# EAGLE design BB (EAGLE 5.11)
BOM: EXCLUDE; PARTNO: RMCF0402JT4K70

## Sheet 1 of 4
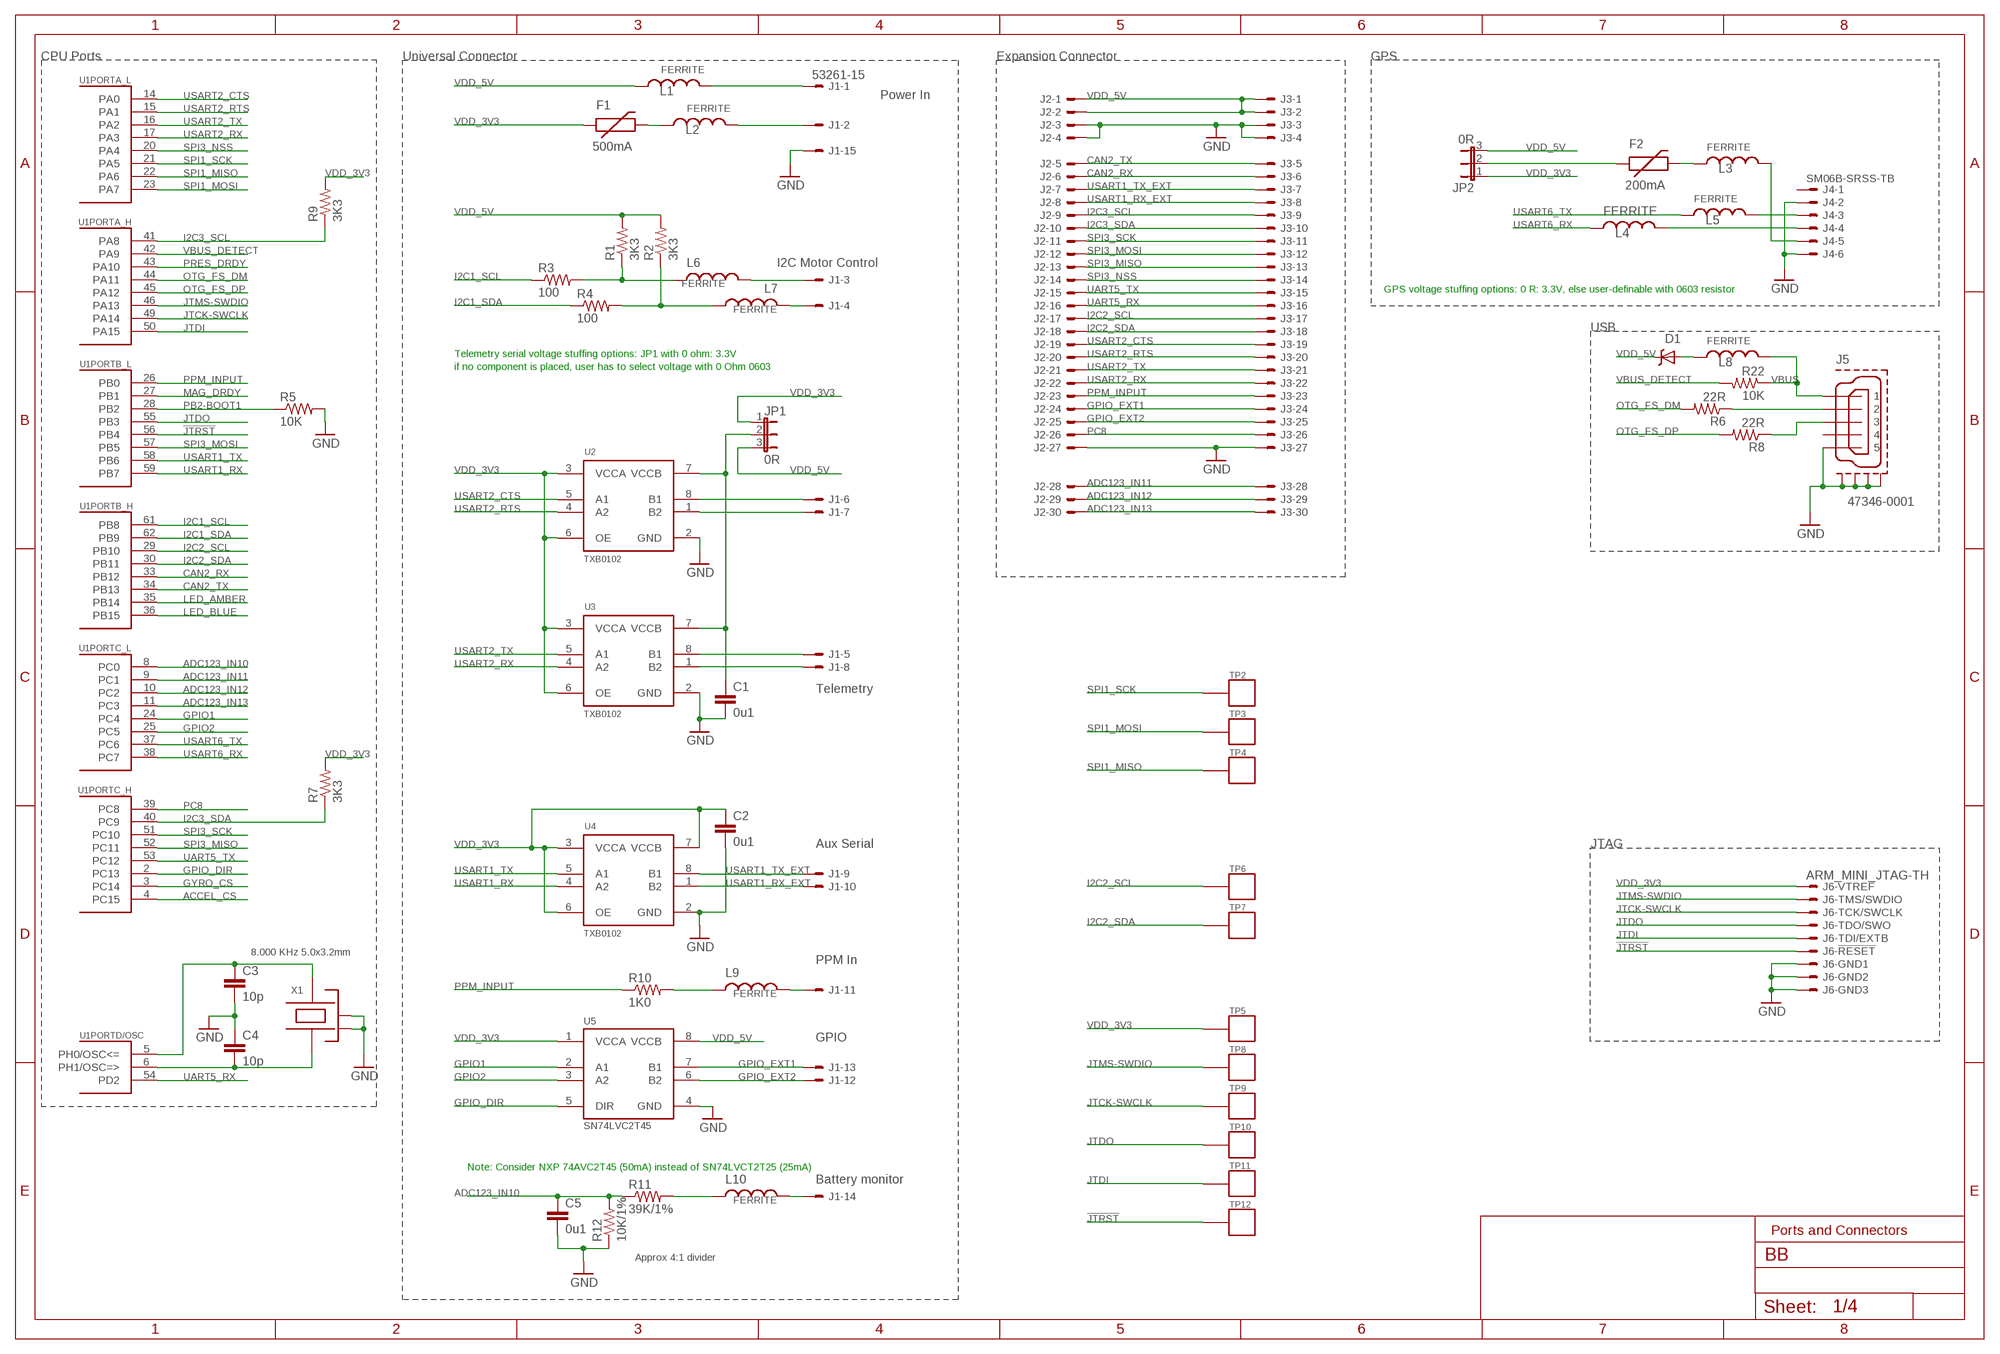
[diagram p0: schematic, sheet 1]

### Parts
C1  0u1  CAP0402-CAP  [0402-CAP]
C2  0u1  CAP0402-CAP  [0402-CAP]
C3  10p  CAP0402-CAP  [0402-CAP]
C4  10p  CAP0402-CAP  [0402-CAP]
C5  0u1  CAP0402-CAP  [0402-CAP]
D1  MSS1P4-M3  DIODE-SCHOTTKY_MSMP  [MICROSMP]
F1  500mA  PTC0402  [0402-PTC]
F2  200mA  PTC0402  [0402-PTC]
J1  53261-15  [53261-15]
J2  HEADER_2X15-REV  [HEADER_2MM_2X15_REVERSE]
J3  HEADER_2X15  [HEADER_2MM_2X15]
J4  SM06B-SRSS-TB  [SM06B-SRSS-TB]
J5  47346-0001  MOLEX-47346-0001  [MOLEX-47346-0001]
J6  ARM_MINI_JTAG-TH  [FTSH-105-01-XXX-DV]
JP1  0R  JUMPER-30603  [SJ_3_0603_PASTE1&2]
JP2  0R  JUMPER-30603  [SJ_3_0603_PASTE1&2]
L1  FERRITE  INDUCTOR0402  [0402-IND]
L2  FERRITE  INDUCTOR0402  [0402-IND]
L3  FERRITE  INDUCTOR0402  [0402-IND]
L4  FERRITE  INDUCTOR0402  [0402-IND]
L5  FERRITE  INDUCTOR0402  [0402-IND]
L6  FERRITE  INDUCTOR0402  [0402-IND]
L7  FERRITE  INDUCTOR0402  [0402-IND]
L8  FERRITE  INDUCTOR0402  [0402-IND]
L9  FERRITE  INDUCTOR0402  [0402-IND]
L10  FERRITE  INDUCTOR0402  [0402-IND]
R1  3K3  RESISTOR0402-RES  [0402-RES]
R2  3K3  RESISTOR0402-RES  [0402-RES]
R3  100  RESISTOR0402-RES  [0402-RES]
R4  100  RESISTOR0402-RES  [0402-RES]
R5  10K  RESISTOR0402-RES  [0402-RES]
R6  22R  RESISTOR0402-RES  [0402-RES]
R7  3K3  RESISTOR0402-RES  [0402-RES]
R8  22R  RESISTOR0402-RES  [0402-RES]
R9  3K3  RESISTOR0402-RES  [0402-RES]
R10  1K0  RESISTOR0402-RES  [0402-RES]
R11  39K/1%  RESISTOR0402-RES  [0402-RES]
R12  10K/1%  RESISTOR0402-RES  [0402-RES]
R22  10K  RESISTOR0402-RES  [0402-RES]
TP2  PAD.03  [PAD.03X.03]
TP3  PAD.03  [PAD.03X.03]
TP4  PAD.03  [PAD.03X.03]
TP5  PAD.03  [PAD.03X.03]
TP6  PAD.03  [PAD.03X.03]
TP7  PAD.03  [PAD.03X.03]
TP8  PAD.03  [PAD.03X.03]
TP9  PAD.03  [PAD.03X.03]
TP10  PAD.03  [PAD.03X.03]
TP11  PAD.03  [PAD.03X.03]
TP12  PAD.03  [PAD.03X.03]
U1  STM32F205RGT6  STM32F20X_TQFP64  [TQFP64]
U2  TXB0102  TXB0102DCUR  [TI-DCU]
U3  TXB0102  TXB0102DCUR  [TI-DCU]
U4  TXB0102  TXB0102DCUR  [TI-DCU]
U5  SN74LVC2T45  SN74LVC2T45DCUR  [TI-DCU]
X1  8.000 KHz 5.0x3.2mm  OSCILLATOR  [OSCILLATOR-5.0X3.2]

### Nets
!JTRST: J6.10 TP12.P$1 U1.56(PORTB_L:PB4)
ACCEL_CS: U1.4(PORTC_H:PC15) ; also sheet 3
ADC123_IN10: C5.1 R11.1 R12.2 U1.8(PORTC_L:PC0)
ADC123_IN11: J2.28 J3.28 U1.9(PORTC_L:PC1)
ADC123_IN12: J2.29 J3.29 U1.10(PORTC_L:PC2)
ADC123_IN13: J2.30 J3.30 U1.11(PORTC_L:PC3)
CAN2_RX: J2.6 J3.6 U1.33(PORTB_H:PB12)
CAN2_TX: J2.5 J3.5 U1.34(PORTB_H:PB13)
GND [power]: C1.2 C2.2 C3.2 C4.1 C5.2 J1.15 J2.3 J2.4 J2.27 J3.3 J3.4 J3.27 J4.2 J4.6 J5.5 J5.GND1 J5.GND2 J5.GND3 J5.GND4 J6.3 J6.5 J6.9 R5.2 R12.1 U2.2(GND) U3.2(GND) U4.2(GND) U5.4(GND) X1.2(NC_2) X1.4(NC_4) ; also sheet 2,3,4
GPIO1: U1.24(PORTC_L:PC4) U5.2(A1)
GPIO2: U1.25(PORTC_L:PC5) U5.3(A2)
GPIO_DIR: U1.2(PORTC_H:PC13) U5.5(DIR)
GPIO_EXT1: J1.13 J2.24 J3.24 U5.7(B1)
GPIO_EXT2: J1.12 J2.25 J3.25 U5.6(B2)
GYRO_CS: U1.3(PORTC_H:PC14) ; also sheet 3
I2C1_SCL: R3.1 U1.61(PORTB_H:PB8)
I2C1_SCL_EXT: L6.1 R1.1 R3.2
I2C1_SDA: R4.1 U1.62(PORTB_H:PB9)
I2C2_SCL: J2.17 J3.17 TP6.P$1 U1.29(PORTB_H:PB10) ; also sheet 2,3,4
I2C2_SDA: J2.18 J3.18 TP7.P$1 U1.30(PORTB_H:PB11) ; also sheet 2,3,4
I2C2_SDA_EXT: L7.1 R2.1 R4.2
I2C3_SCL: J2.9 J3.9 R9.1 U1.41(PORTA_H:PA8)
I2C3_SDA: J2.10 J3.10 R7.1 U1.40(PORTC_H:PC9)
JTCK-SWCLK: J6.4 TP9.P$1 U1.49(PORTA_H:PA14)
JTDI: J6.8 TP11.P$1 U1.50(PORTA_H:PA15)
JTDO: J6.6 TP10.P$1 U1.55(PORTB_L:PB3)
JTMS-SWDIO: J6.2 TP8.P$1 U1.46(PORTA_H:PA13)
LED_AMBER: U1.35(PORTB_H:PB14) ; also sheet 2
LED_BLUE: U1.36(PORTB_H:PB15) ; also sheet 2
MAG_DRDY: U1.27(PORTB_L:PB1) ; also sheet 3,4
N$1: C4.2 U1.6(PORTD/OSC:PH1/OSC=>) X1.1
N$2: C3.1 U1.5(PORTD/OSC:PH0/OSC<=) X1.3
N$3: J1.2 L2.2
N$5: F2.2 L3.1
N$8: J4.4 L4.2
N$11 [power]: C1.1 JP1.2 U2.7(VCCB) U3.7(VCCB)
N$12: J1.6 U2.8(B1)
N$13: J1.7 U2.1(B2)
N$14 [power]: J1.1 L1.2
N$15: J1.5 U3.8(B1)
N$16: J1.8 U3.1(B2)
N$18: F2.1 JP2.2
N$19: J1.3 L6.2
N$23 [power]: D1.ANODE(A) L8.1
N$24 [power]: J4.5 L3.2
N$25: J4.3 L5.2
N$26: J1.4 L7.2
N$27 [power]: F1.2 L2.1
N$31: L9.1 R10.2
N$32: J1.11 L9.2
N$35: L10.1 R11.2
N$37: J1.14 L10.2
OTG_DM: J5.2 R6.1
OTG_DP: J5.3 R8.1
OTG_FS_DM: R6.2 U1.44(PORTA_H:PA11)
OTG_FS_DP: R8.2 U1.45(PORTA_H:PA12)
PB2-BOOT1: R5.1 U1.28(PORTB_L:PB2)
PC8: J2.26 J3.26 U1.39(PORTC_H:PC8)
PPM_INPUT: J2.23 J3.23 R10.1 U1.26(PORTB_L:PB0)
PRES_DRDY: U1.43(PORTA_H:PA10) ; also sheet 3
SPI1_MISO: TP4.P$1 U1.22(PORTA_L:PA6) ; also sheet 3
SPI1_MOSI: TP3.P$1 U1.23(PORTA_L:PA7) ; also sheet 3
SPI1_SCK: TP2.P$1 U1.21(PORTA_L:PA5) ; also sheet 3
SPI3_MISO: J2.13 J3.13 U1.52(PORTC_H:PC11)
SPI3_MOSI: J2.12 J3.12 U1.57(PORTB_L:PB5)
SPI3_NSS: J2.14 J3.14 U1.20(PORTA_L:PA4)
SPI3_SCK: J2.11 J3.11 U1.51(PORTC_H:PC10)
UART5_RX: J2.16 J3.16 U1.54(PORTD/OSC:PD2)
UART5_TX: J2.15 J3.15 U1.53(PORTC_H:PC12)
USART1_RX: U1.59(PORTB_L:PB7) U4.4(A2)
USART1_RX_EXT: J1.10 J2.8 J3.8 U4.1(B2)
USART1_TX: U1.58(PORTB_L:PB6) U4.5(A1)
USART1_TX_EXT: J1.9 J2.7 J3.7 U4.8(B1)
USART2_CTS: J2.19 J3.19 U1.14(PORTA_L:PA0) U2.5(A1)
USART2_RTS: J2.20 J3.20 U1.15(PORTA_L:PA1) U2.4(A2)
USART2_RX: J2.22 J3.22 U1.17(PORTA_L:PA3) U3.4(A2)
USART2_TX: J2.21 J3.21 U1.16(PORTA_L:PA2) U3.5(A1)
USART6_RX: L4.1 U1.38(PORTC_L:PC7)
USART6_TX: L5.1 U1.37(PORTC_L:PC6)
VBUS [power]: J5.1 L8.2 R22.1
VBUS_DETECT: R22.2 U1.42(PORTA_H:PA9)
VDD_3V3 [power]: C2.1 F1.1 J6.1 JP1.1 JP2.1 R7.2 R9.2 TP5.P$1 U2.3(VCCA) U2.6(OE) U3.3(VCCA) U3.6(OE) U4.3(VCCA) U4.6(OE) U4.7(VCCB) U5.1(VCCA) ; also sheet 2,3
VDD_5V [power]: D1.CATHODE(C) J2.1 J2.2 J3.1 J3.2 JP1.3 JP2.3 L1.1 R1.2 R2.2 U5.8(VCCB) ; also sheet 2
Unconnected: J4.1 J5.4

### Notes on the sheet
- CPU Ports | Universal Connector | Expansion Connector | GPS
- Power In
- I2C Motor Control
- GPS voltage stuffing options: 0 R: 3.3V, else user-definable with 0603 resistor
- USB
- Telemetry serial voltage stuffing options: JP1 with 0 ohm: 3.3V
- if no component is placed, user has to select voltage with 0 Ohm 0603
- Telemetry
- Aux Serial | JTAG
- PPM In
- GPIO
- Note: Consider NXP 74AVC2T45 (50mA) instead of SN74LVCT2T25 (25mA)
- Battery monitor
- Ports and Connectors
- Approx 4:1 divider

## Sheet 2 of 4
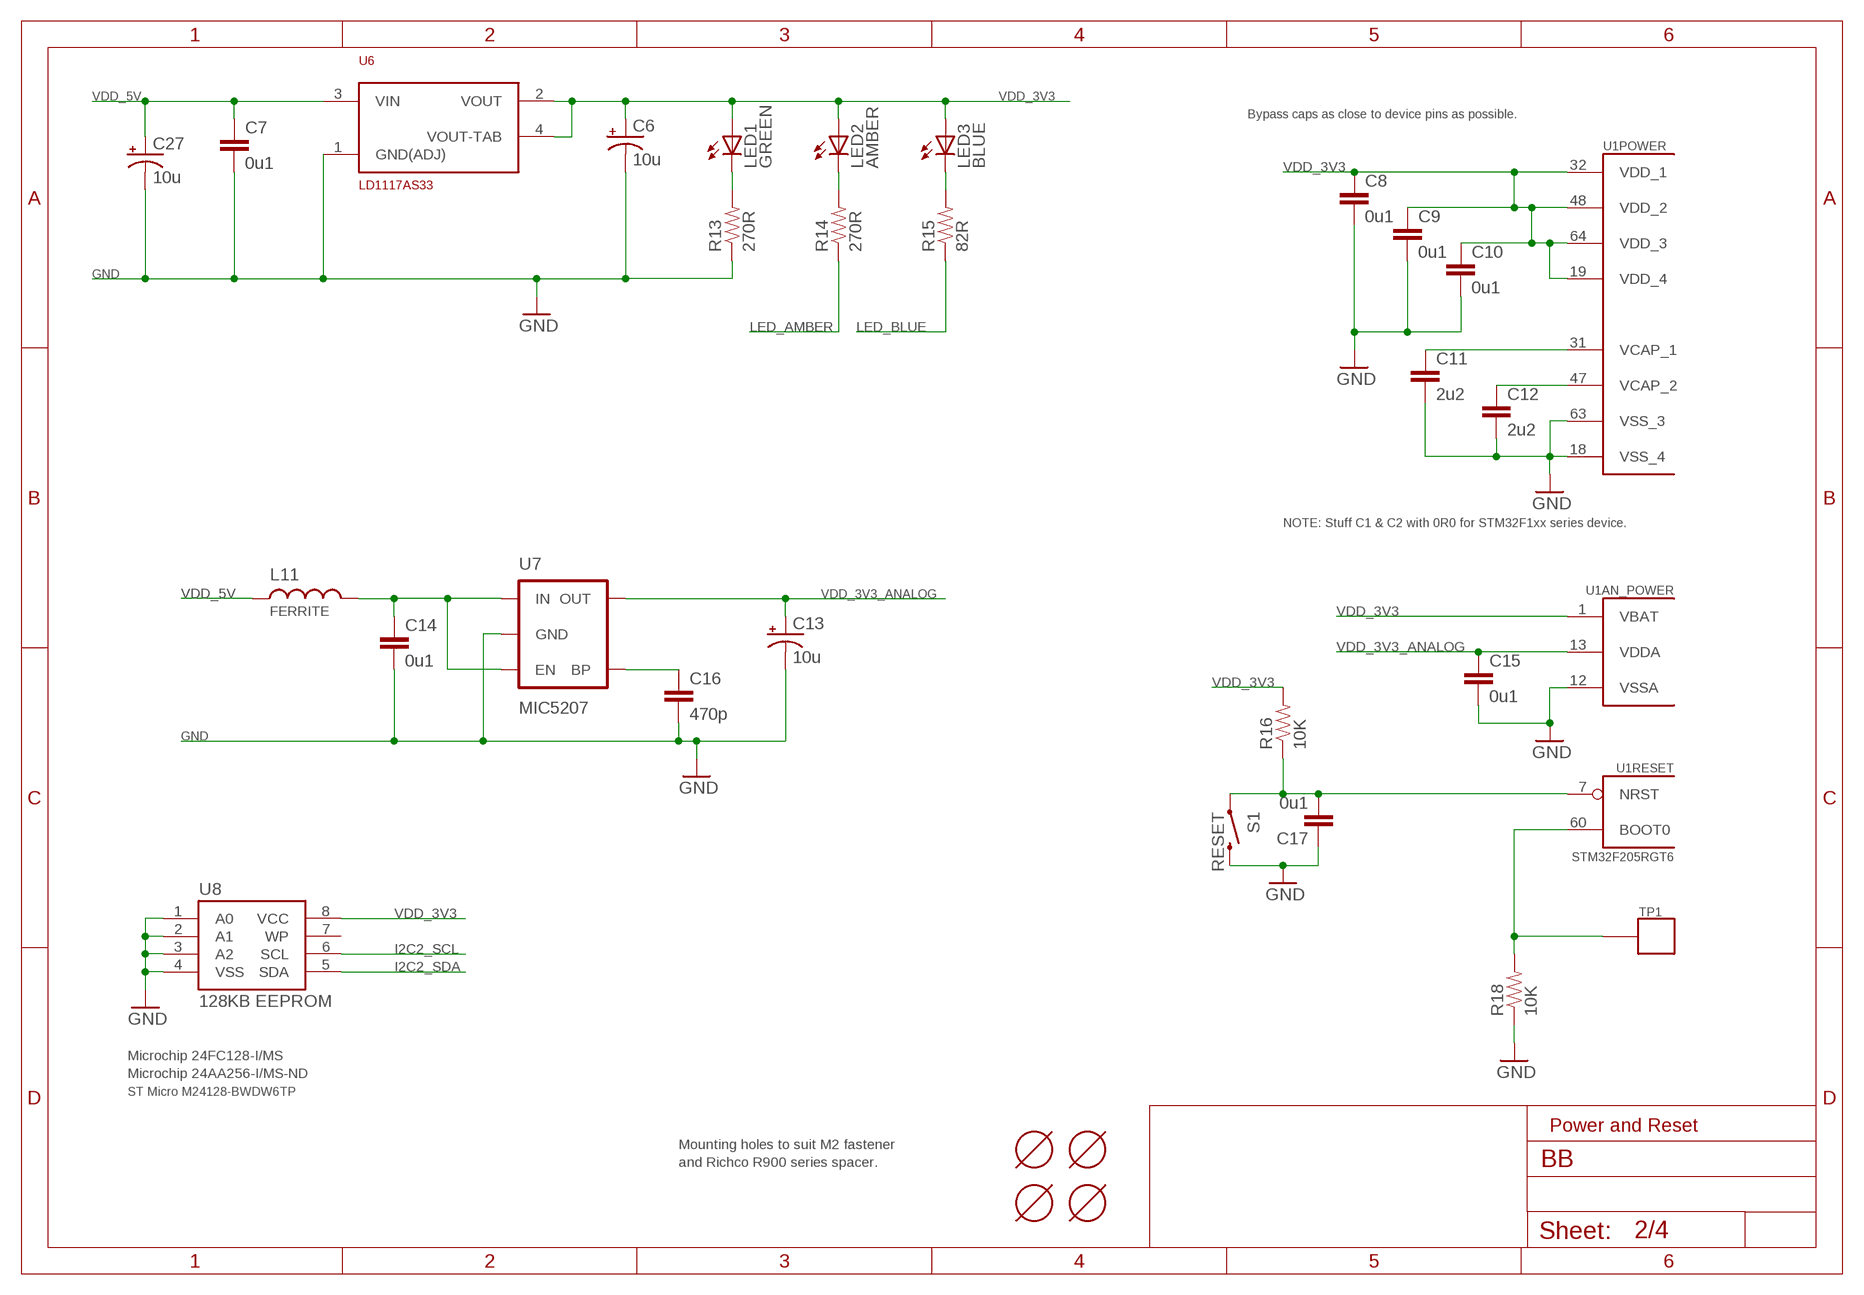
[diagram p1: schematic, sheet 2]

### Parts
C6  10u  CAP_POL1206  [EIA3216]
C7  0u1  CAP0402-CAP  [0402-CAP]
C8  0u1  CAP0402-CAP  [0402-CAP]
C9  0u1  CAP0402-CAP  [0402-CAP]
C10  0u1  CAP0402-CAP  [0402-CAP]
C11  2u2  CAP0402-CAP  [0402-CAP]
C12  2u2  CAP0402-CAP  [0402-CAP]
C13  10u  CAP_POL1206  [EIA3216]
C14  0u1  CAP0402-CAP  [0402-CAP]
C15  0u1  CAP0402-CAP  [0402-CAP]
C16  470p  CAP0402-CAP  [0402-CAP]
C17  0u1  CAP0402-CAP  [0402-CAP]
C27  10u  CAP_POL1206  [EIA3216]
L11  FERRITE  INDUCTOR0402  [0402-IND]
LED1  GREEN  LED0603  [LED-0603]
LED2  AMBER  LED0603  [LED-0603]
LED3  BLUE  LED0603  [LED-0603]
R13  270R  RESISTOR0402-RES  [0402-RES]
R14  270R  RESISTOR0402-RES  [0402-RES]
R15  82R  RESISTOR0402-RES  [0402-RES]
R16  10K  RESISTOR0402-RES  [0402-RES]
R18  10K  RESISTOR0402-RES  [0402-RES]
S1  RESET  SWITCH-MOMENTARY-2  [EVQP7J01K]
TP1  PAD.03  [PAD.03X.03]
U6  LD1117AS33  [SOT-223]
U7  MIC5207  V_REG_LDOSMD  [SOT23-5]
U8  128KB EEPROM  EEPROM-I2CMSOP  [MSOP-8]
U$1  MOUNT-HOLE2.1MM  [MOUNT-HOLE2.1]
U$2  MOUNT-HOLE2.1MM  [MOUNT-HOLE2.1]
U$3  MOUNT-HOLE2.1MM  [MOUNT-HOLE2.1]
U$4  MOUNT-HOLE2.1MM  [MOUNT-HOLE2.1]

### Nets
BOOT0: R18.2 TP1.P$1 U1.60(RESET:BOOT0)
GND [power]: C6.C(-) C7.2 C8.2 C9.2 C10.2 C11.2 C12.2 C13.C(-) C14.2 C15.2 C16.2 C17.1 C27.C(-) R13.1 R18.1 S1.B3 U1.12(AN_POWER:VSSA) U1.18(POWER:VSS_4) U1.63(POWER:VSS_3) U6.1(GND(ADJ)) U7.2(GND) U8.1(A0) U8.2(A1) U8.3(A2) U8.4(VSS) ; also sheet 1,3,4
I2C2_SCL: U8.6(SCL) ; also sheet 1,3,4
I2C2_SDA: U8.5(SDA) ; also sheet 1,3,4
LED_AMBER: R14.1 ; also sheet 1
LED_BLUE: R15.1 ; also sheet 1
N$4: C11.1 U1.31(POWER:VCAP_1)
N$6: C12.1 U1.47(POWER:VCAP_2)
N$9: C16.1 U7.4(BP)
N$22: C17.2 R16.1 S1.A1 U1.7(RESET:NRST)
N$28: LED3.C R15.2
N$29: LED1.C R13.2
N$30: LED2.C R14.2
N$100 [power]: C14.1 L11.2 U7.1(IN) U7.3(EN)
VDD_3V3 [power]: C6.A(+) C8.1 C9.1 C10.1 LED1.A LED2.A LED3.A R16.2 U1.1(AN_POWER:VBAT) U1.19(POWER:VDD_4) U1.32(POWER:VDD_1) U1.48(POWER:VDD_2) U1.64(POWER:VDD_3) U6.2(VOUT) U6.4(VOUT-TAB) U8.8(VCC) ; also sheet 1,3
VDD_3V3_ANALOG [power]: C13.A(+) C15.1 U1.13(AN_POWER:VDDA) U7.5(OUT) ; also sheet 3,4
VDD_5V [power]: C7.1 C27.A(+) L11.1 U6.3(VIN) ; also sheet 1
Unconnected: U8.7(WP)

### Notes on the sheet
- Bypass caps as close to device pins as possible.
- NOTE: Stuff C1 & C2 with 0R0 for STM32F1xx series device.
- Microchip 24FC128-I/MS
- Microchip 24AA256-I/MS-ND
- ST Micro M24128-BWDW6TP
- Power and Reset
- Mounting holes to suit M2 fastener
- and Richco R900 series spacer.

## Sheet 3 of 4
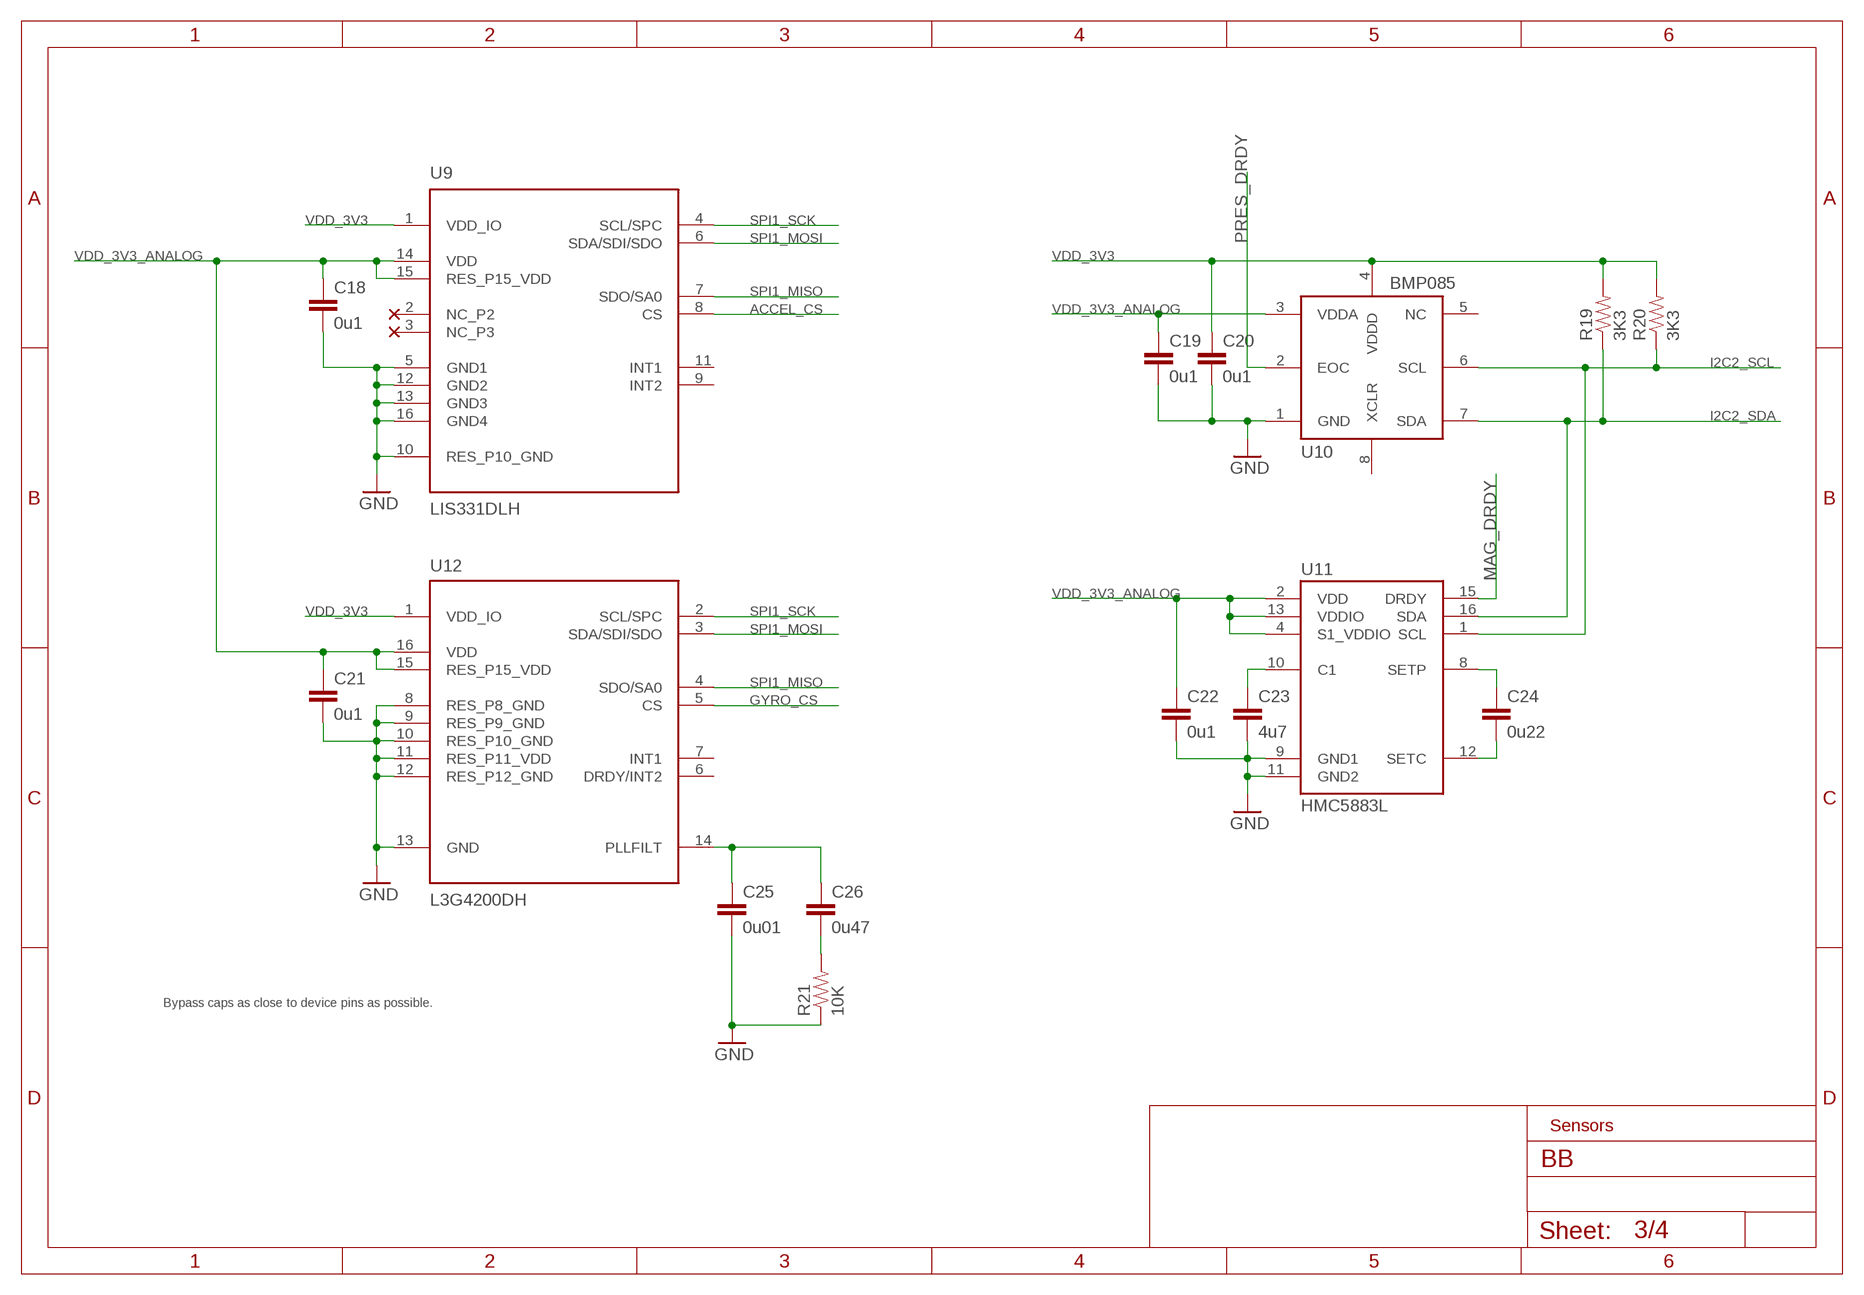
[diagram p2: schematic, sheet 3]

### Parts
C18  0u1  CAP0402-CAP  [0402-CAP]
C19  0u1  CAP0402-CAP  [0402-CAP]
C20  0u1  CAP0402-CAP  [0402-CAP]
C21  0u1  CAP0402-CAP  [0402-CAP]
C22  0u1  CAP0402-CAP  [0402-CAP]
C23  4u7  CAP0402-CAP  [0402-CAP]
C24  0u22  CAP0402-CAP  [0402-CAP]
C25  0u01  CAP0402-CAP  [0402-CAP]
C26  0u47  CAP0402-CAP  [0402-CAP]
R19  3K3  RESISTOR0402-RES  [0402-RES]
R20  3K3  RESISTOR0402-RES  [0402-RES]
R21  10K  RESISTOR0402-RES  [0402-RES]
U9  LIS331DLH  LIS331DLH-LL  [LIS331DLH-MAN]
U10  BMP085  [BMP085]
U11  HMC5883L  [HMC5883L-MAN]
U12  L3G4200DH  L3G4200DH-LL  [L3G4200DH-MAN]

### Nets
ACCEL_CS: U9.8(CS) ; also sheet 1
GND [power]: C18.2 C19.2 C20.2 C21.2 C22.2 C23.2 C25.2 R21.1 U9.5(GND1) U9.10(RES_P10_GND) U9.12(GND2) U9.13(GND3) U9.16(GND4) U10.1(GND) U11.9(GND1) U11.11(GND2) U12.8(RES_P8_GND) U12.9(RES_P9_GND) U12.10(RES_P10_GND) U12.11(RES_P11_VDD) U12.12(RES_P12_GND) U12.13(GND) ; also sheet 1,2,4
GYRO_CS: U12.5(CS) ; also sheet 1
I2C2_SCL: R20.1 U10.6(SCL) U11.1(SCL) ; also sheet 1,2,4
I2C2_SDA: R19.1 U10.7(SDA) U11.16(SDA) ; also sheet 1,2,4
MAG_DRDY: U11.15(DRDY) ; also sheet 1,4
N$10: C24.1 U11.8(SETP)
N$17: C24.2 U11.12(SETC)
N$33: C26.2 R21.2
N$34: C25.1 C26.1 U12.14(PLLFILT)
N$36: C23.1 U11.10(C1)
PRES_DRDY: U10.2(EOC) ; also sheet 1
SPI1_MISO: U9.7(SDO/SA0) U12.4(SDO/SA0) ; also sheet 1
SPI1_MOSI: U9.6(SDA/SDI/SDO) U12.3(SDA/SDI/SDO) ; also sheet 1
SPI1_SCK: U9.4(SCL/SPC) U12.2(SCL/SPC) ; also sheet 1
VDD_3V3 [power]: C20.1 R19.2 R20.2 U9.1(VDD_IO) U10.4(VDDD) U12.1(VDD_IO) ; also sheet 1,2
VDD_3V3_ANALOG [power]: C18.1 C19.1 C21.1 C22.1 U9.14(VDD) U9.15(RES_P15_VDD) U10.3(VDDA) U11.2(VDD) U11.4(S1_VDDIO) U11.13(VDDIO) U12.15(RES_P15_VDD) U12.16(VDD) ; also sheet 2,4
Unconnected: U9.2(NC_P2) U9.3(NC_P3) U9.9(INT2) U9.11(INT1) U10.5(NC) U10.8(XCLR) U11.3(NC_P3) U11.5(NC_P5) U11.6(NC_P6) U11.7(NC_P7) U11.14(NC_P14) U12.6(DRDY/INT2) U12.7(INT1)

### Notes on the sheet
- Bypass caps as close to device pins as possible.
- Sensors

## Sheet 4 of 4
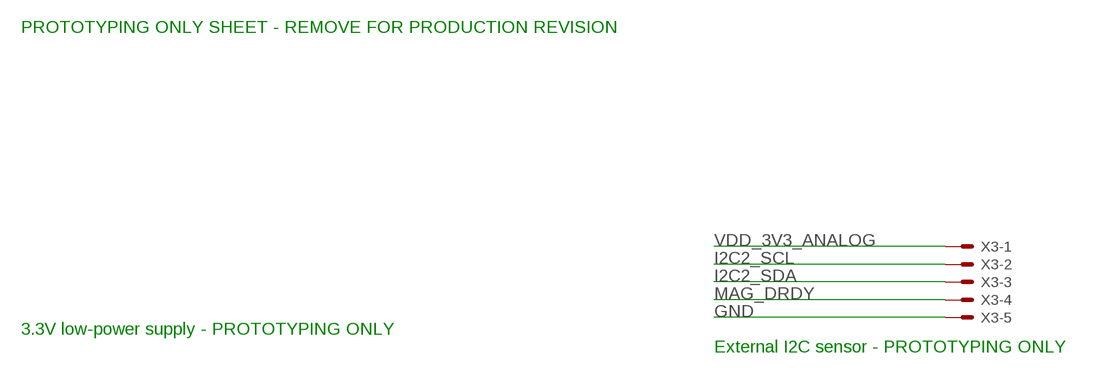
[diagram p3: schematic, sheet 4]

### Parts
X3  53261-05  [53261-05]

### Nets
GND [power]: X3.5 ; also sheet 1,2,3
I2C2_SCL: X3.2 ; also sheet 1,2,3
I2C2_SDA: X3.3 ; also sheet 1,2,3
MAG_DRDY: X3.4 ; also sheet 1,3
VDD_3V3_ANALOG [power]: X3.1 ; also sheet 2,3

### Notes on the sheet
- PROTOTYPING ONLY SHEET - REMOVE FOR PRODUCTION REVISION
- 3.3V low-power supply - PROTOTYPING ONLY
- External I2C sensor - PROTOTYPING ONLY

## Library data of the parts
C1-C5 C7-C12 C14-C26 = pixhawk2:CAP: Capacitor Standard 0603 ceramic capacitor, and 0.1" leaded capacitor.
C6 C13 C27 = pixhawk2:CAP_POL: Capacitor Polarized These are standard SMD and PTH capacitors. Normally 10uF, 47uF, and 100uF in electrolytic and tantalum varieties. Always verify the external diameter of the through hole cap, it varies with capacity, voltage, and manufacturer. The EIA devices should be standard.
D1 = pixhawk2:DIODE-SCHOTTKY: Schottky barrier diode in DO214AC, e.g. Fairchild SS14.
F1 F2 = pixhawk2:PTC: Resettable Fuse PTC Resettable Fuse. Spark Fun Electronics SKU : COM-08357
J1 = pixhawk2:53?-15: CONNECTOR wire to board 1.25 mm (.049 inch) pitch header
J2 J3 = pixhawk2:HEADER_2X15: 2X15 header
J4 = pixhawk2:?M06B-SRSS-TB: Disconnectable Crimp style connector, 1.0mm pitch 6 contacts
J5 = pixhawk2:MOLEX-47346-0001: MICRO USB B, BOTTOM MOUNT
J6 = pixhawk2:ARM_MINI_JTAG: CONNECTOR wire to board 1.25 mm (.049 inch) pitch header
JP1 JP2 = pixhawk2:JUMPER-3
L1-L11 = pixhawk2:INDUCTOR: Inductors Basic Inductor/Choke - 0603 and 1206. Footprints are not proven and vary greatly between part numbers.
LED1-LED3 = pixhawk2:LED: LEDs Standard schematic elements and footprints for 5mm, 3mm, 1206, and 0603 sized LEDs. 5mm - Spark Fun Electronics SKU : COM-00529 (and others)
R1-R16 R18-R22 = pixhawk2:RESISTOR: Resistor Basic schematic elements and footprints for 0603, 1206, and PTH 1/10th watt (small) resistors.
S1 = pixhawk2:SWITCH-MOMENTARY-2
TP1-TP12 = pixhawk2:PAD
U1 = pixhawk2:STM32F20X_TQFP64: STM32F20x 64pin LQFP
U2-U4 = pixhawk2:TXB0102: 2-BIT BIDIRECTIONAL VOLTAGE-LEVEL TRANSLATOR WITH AUTO DIRECTION SENSING AND ±15-kV ESD PROTECTION
U5 = pixhawk2:SN74LVC2T45: DUAL-BIT DUAL-SUPPLY BUS TRANSCEIVER WITH CONFIGURABLE VOLTAGE TRANSLATION AND 3-STATE OUTPUTS
U6 = pixhawk2:LD1117A: LD1117A LDO Datasheet: http://www.st.com/stonline/books/pdf/docs/7194.pdf
U7 = pixhawk2:V_REG_LDO: Voltage Regulator LDO Standard 150mA LDO voltage regulator in SOT-23 layout. Micrel part MIC5205. BP (by-pass) pin is used to lower output noise with 470pF cap.
U8 = pixhawk2:EEPROM-I2C
U9 = pixhawk2:LIS331DLH: LIS331DLH - Digital 3-axis accelerometer The LIS331DLH is an ultra low-power high performance three axes linear accelerometer belonging to the ?nano? family, with digital I2C/SPI serial interface standard output. The LIS331DLH has dynamically user selectable full scales of ±2g/±4g/±8g and it is capable of measuring accelerations with output data rates from 0.5 Hz to 1 kHz. It is guaranteed to operate over an extended temperature range from -40 °C to +85 °C. LIS331DLH Datasheet <http://www.st.com/internet/com/TECHNICAL_RESOURCES/TECHNICAL_LITERATURE/DATASHEET/CD00213470.pdf>
U10 = pixhawk2:BMP085
U11 = pixhawk2:HMC5883L: Honeywell HMC5883L 12bit Magnetometer
U12 = pixhawk2:L3G4200DH: L3G4200DH - Digital 3-axis Gyroscope The L3G4200DH is a low-power three-axis angular rate sensor. The L3G4200DH has a full scale of ±250/±500/ ±2000 dps and is capable of measuring rates with a user-selectable bandwidth. It can operate within a temperature range from -40 °C to +85 °C. Supply voltage: 2.4 V to 3.6 V. Full datasheet: L3G4200DH Datasheet <http://www.st.com/stonline/products/literature/ds/17300.pdf>
U$1-U$4 = pixhawk2:MOUNT-HOLE
X1 = pixhawk2:OSCILLATOR: Crystal Oscillator in 3.2x2.5 SMD
X3 = pixhawk2:53?-05: CONNECTOR wire to board 1.25 mm (.049 inch) pitch header

## Net classes
0 signal: width 0.203 mm, drill 0.3 mm, clearance 0.203 mm
1 power: width 0.254 mm, drill 0.3 mm, clearance 0.203 mm

## Board
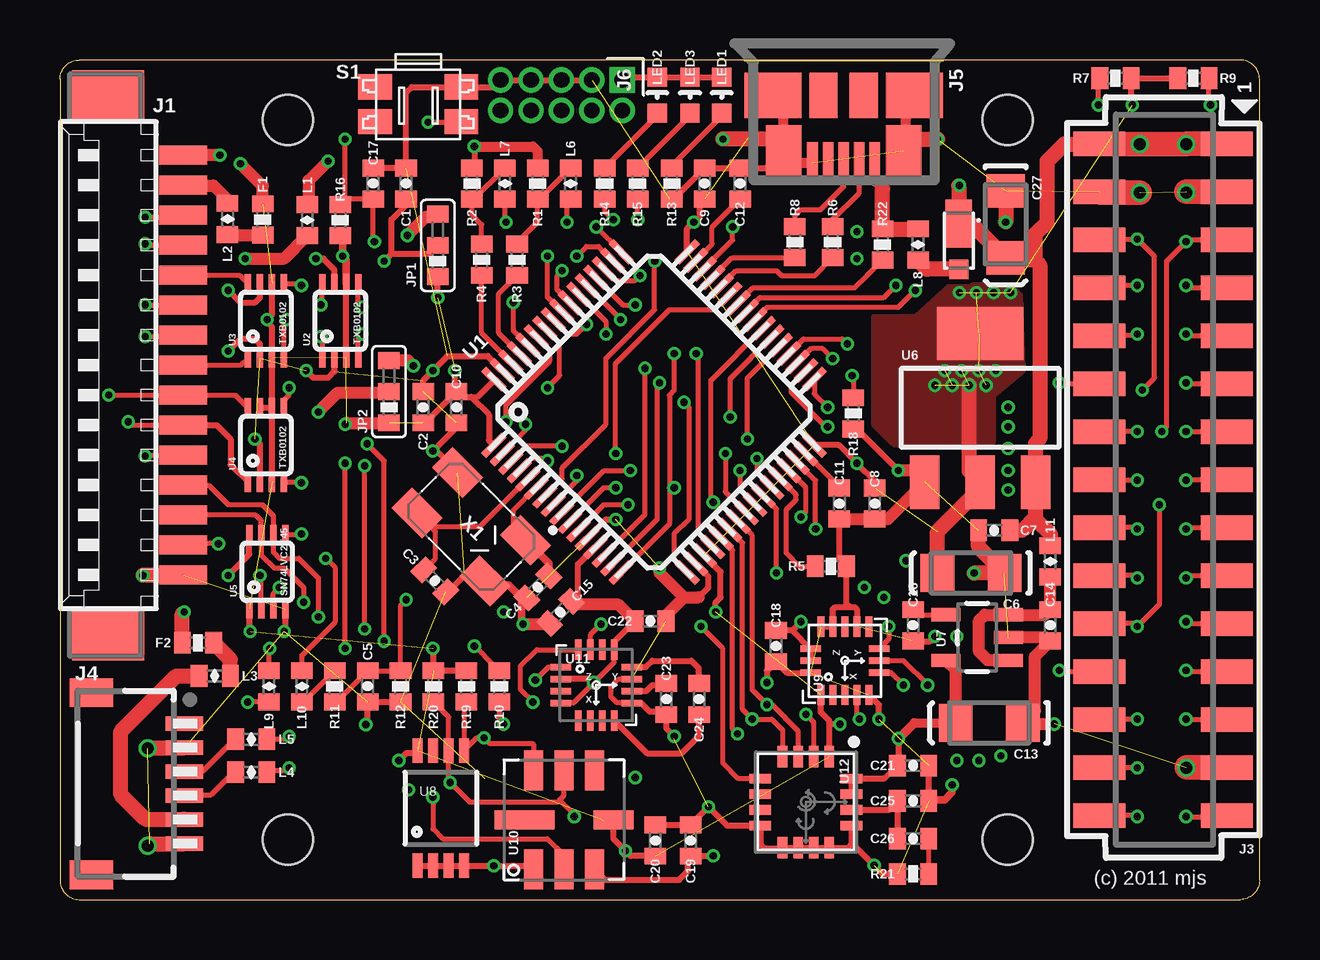
[diagram p4: board, top side]
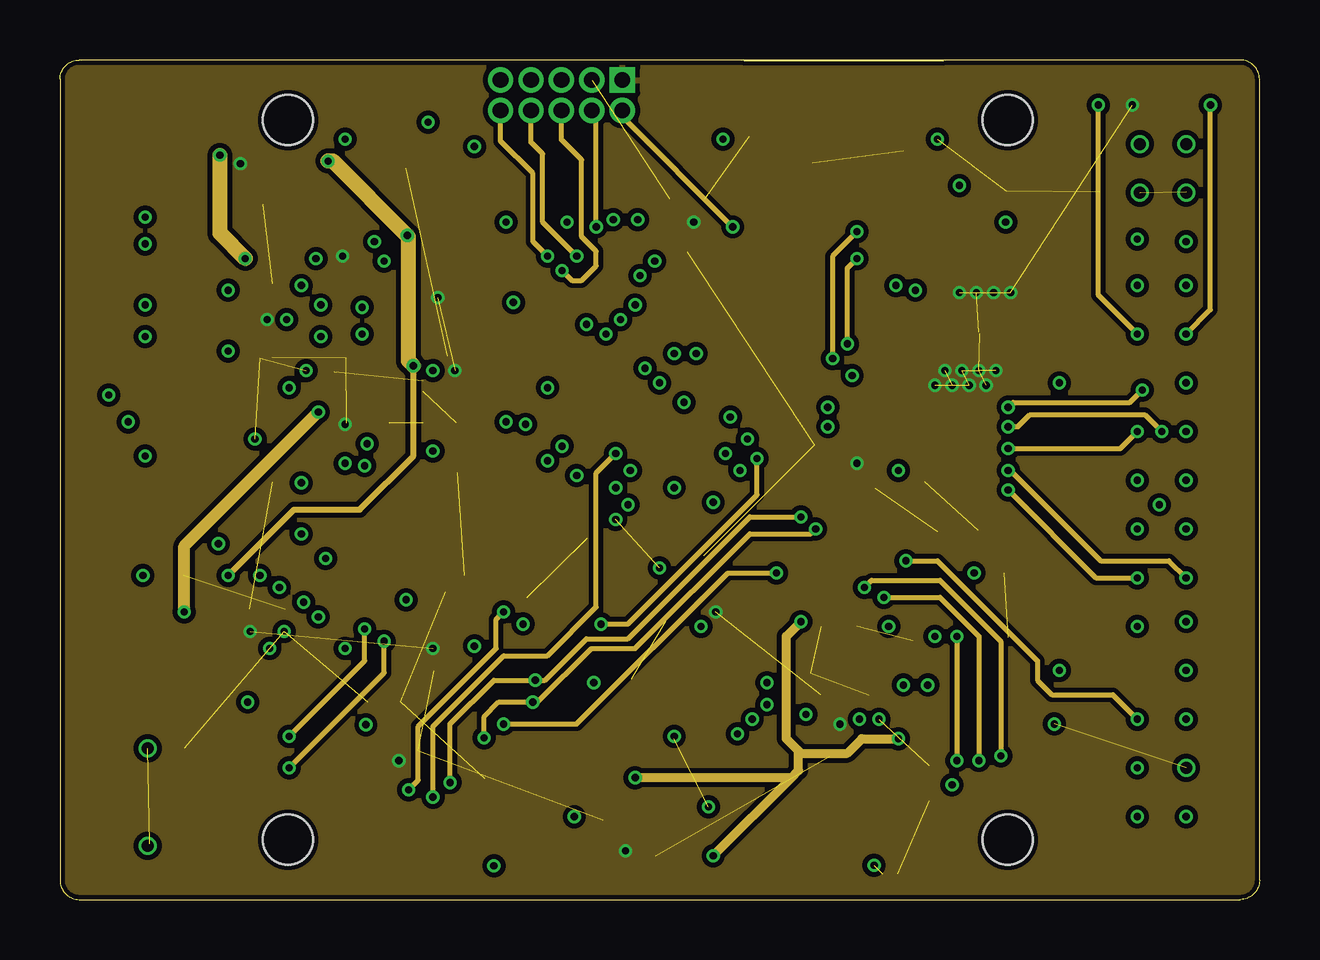
[diagram p5: board, inner layer Route2]
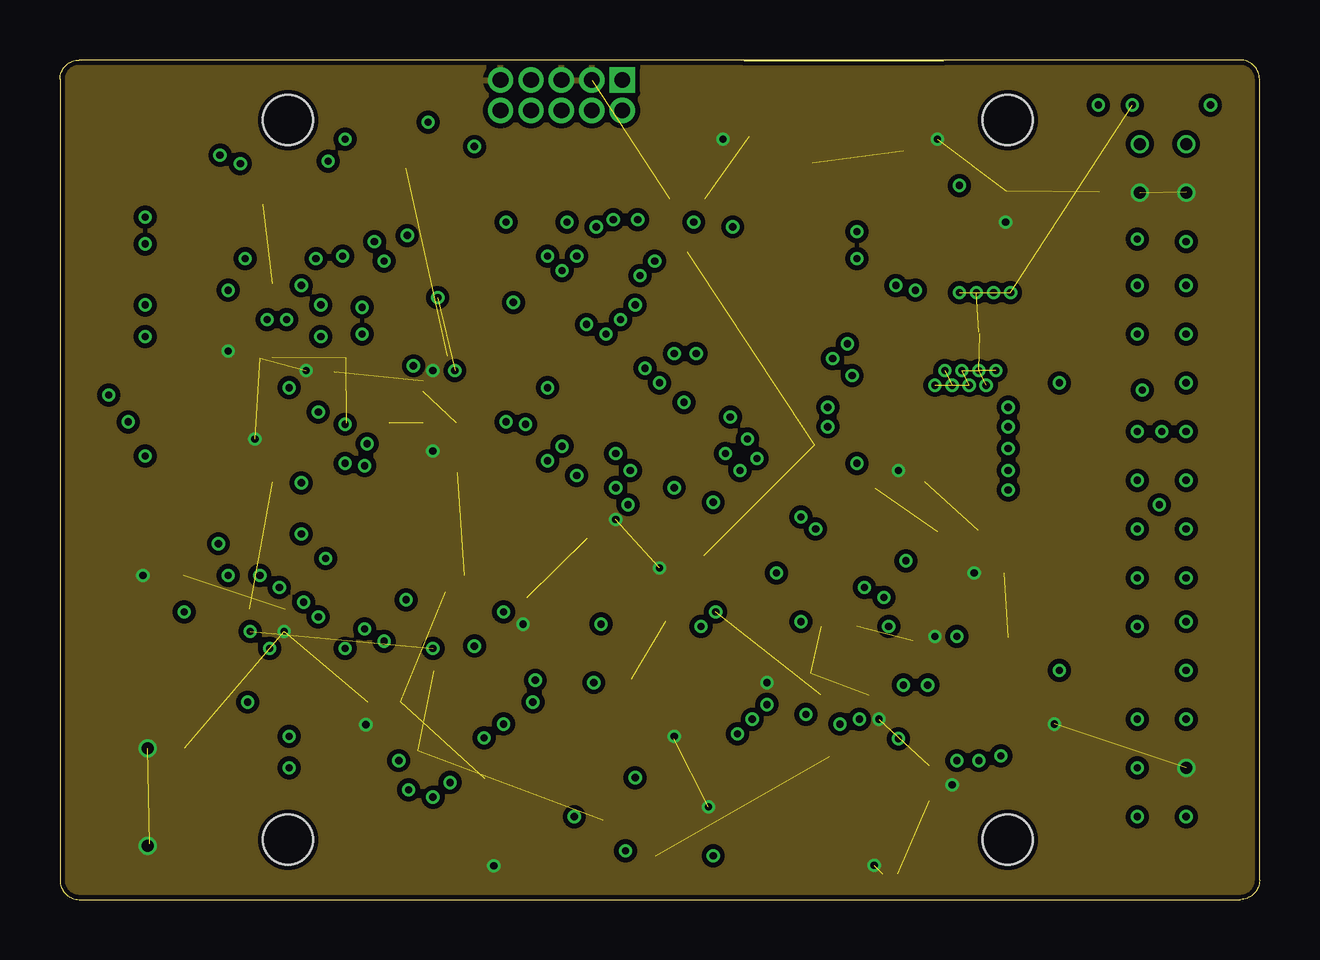
[diagram p6: board, inner layer Route15]
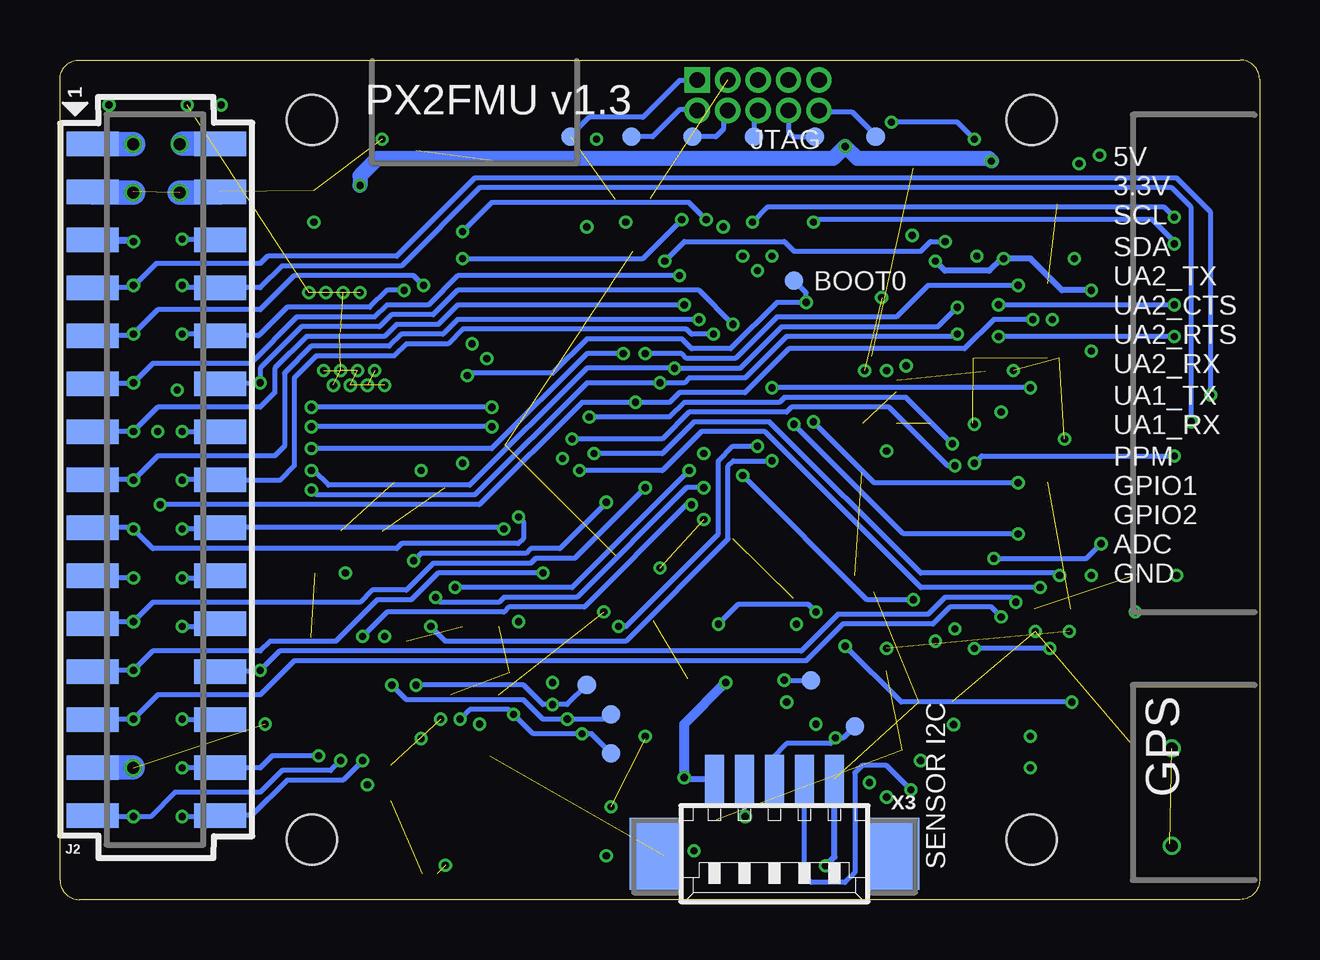
[diagram p7: board, bottom side, seen from below]

Size 50 x 35 mm. Coordinates in mm from the lower left corner, seen from the top.
Outline: 0,0.8 arc90 0.8,0 49.2,0 arc90 50,0.8 50,34.2 arc90 49.2,35 0.8,35 arc90 0,34.2 0,0.8
Copper layers (1*2*15*16): Top 0.035mm / dielectric 0.5mm / Route2 0.035mm / dielectric 0.5mm / Route15 0.035mm / dielectric 0.5mm / Bottom 0.035mm
Design rules "pixhawk2": minimum track width 0.15mm, minimum drill 0.3mm, track to track 0.15mm, track to pad 0.15mm, pad to pad 0.15mm, via to via 0.15mm, smd to smd 0.15mm, copper to edge 0.2mm, drill to drill 0.2mm, minimum pad ring 0.125mm, minimum via ring 0.125mm, stop-mask expansion 1mil, vias tented up to drill 0.31mm, thermal gap 8mil

### Footprints (pad centres in the part's own frame; a part is rotated, then mirrored left to right if it is on the bottom)
0402-CAP = smd 0.7 x 0.9: 1 -0.65,0; 2 0.65,0
EIA3216 = smd 1.4 x 1.6: A 1.4,0; C -1.4,0
MICROSMP = smd 0.8 x 0.8: ANODE 0.65,0 | smd 2 x 1.1: CATHODE -1.25,0
0402-PTC = smd 0.7 x 0.9: 1 -0.65,0; 2 0.65,0
53261-15 = smd 0.8 x 2: 1 8.75,-2.5; 2 7.5,-2.5; 3 6.25,-2.5; 4 5,-2.5; 5 3.75,-2.5; 6 2.5,-2.5; 7 1.25,-2.5; 8 0,-2.5; 9 -1.25,-2.5; 10 -2.5,-2.5; 11 -3.75,-2.5; 12 -5,-2.5; 13 -6.25,-2.5; 14 -7.5,-2.5; 15 -8.75,-2.5 | smd 2.1 x 3: S1 11.25,0.625; S2 -11.25,0.625
HEADER_2MM_2X15_REVERSE = smd 1.02 x 2.16: 1 -14,-2.655; 2 -14,2.655; 3 -12,-2.655; 4 -12,2.655; 5 -10,-2.655; 6 -10,2.655; 7 -8,-2.655; 8 -8,2.655; 9 -6,-2.655; 10 -6,2.655; 11 -4,-2.655; 12 -4,2.655; 13 -2,-2.655; 14 -2,2.655; 15 0,-2.655; 16 0,2.655; 17 2,-2.655; 18 2,2.655; 19 4,-2.655; 20 4,2.655; 21 6,-2.655; 22 6,2.655; 23 8,-2.655; 24 8,2.655; 25 10,-2.655; 26 10,2.655; 27 12,-2.655; 28 12,2.655; 29 14,-2.655; 30 14,2.655
HEADER_2MM_2X15 = smd 1.02 x 2.16: 1 14,-2.655; 2 14,2.655; 3 12,-2.655; 4 12,2.655; 5 10,-2.655; 6 10,2.655; 7 8,-2.655; 8 8,2.655; 9 6,-2.655; 10 6,2.655; 11 4,-2.655; 12 4,2.655; 13 2,-2.655; 14 2,2.655; 15 0,-2.655; 16 0,2.655; 17 -2,-2.655; 18 -2,2.655; 19 -4,-2.655; 20 -4,2.655; 21 -6,-2.655; 22 -6,2.655; 23 -8,-2.655; 24 -8,2.655; 25 -10,-2.655; 26 -10,2.655; 27 -12,-2.655; 28 -12,2.655; 29 -14,-2.655; 30 -14,2.655
SM06B-SRSS-TB = smd 0.6 x 1.55: 1 -2.5,2.975; 2 -1.5,2.975; 3 -0.5,2.975; 4 0.5,2.975; 5 1.5,2.975; 6 2.5,2.975 | smd 1.2 x 1.8: FIT@1 -3.8,-0.9; FIT@2 3.8,-0.9
MOLEX-47346-0001 = smd 1.7 x 0.44: 1 2.8,1.3; 2 2.8,0.65; 3 2.8,0; 4 2.8,-0.65; 5 2.8,-1.3 | smd 1.9 x 2.375: GND1 0,2.95; GND4 0,-2.95 | smd 2.1 x 1.475: GND2 2.3,2.5; GND3 2.3,-2.5 | smd 1.9 x 1.175: GND5 0,-0.838; GND6 0,0.838
FTSH-105-01-XXX-DV = drill 0.65 pad 1.06 square: 1 0,0 | drill 0.65 pad 1.06 round: 2 0,1.27; 3 1.27,0; 4 1.27,1.27; 5 2.54,0; 6 2.54,1.27; 7 3.81,0; 8 3.81,1.27; 9 5.08,0; 10 5.08,1.27
SJ_3_0603_PASTE1&2 = smd 0.7 x 0.9: 1 -0.65,0; 2 0.65,0; 3 1.95,0
0402-IND = smd 0.7 x 0.9: 1 -0.65,0; 2 0.65,0
LED-0603 = smd 0.8 x 0.8: A 0,-0.75; C 0,0.75
0402-RES = smd 0.7 x 0.9: 1 -0.65,0; 2 0.65,0
EVQP7J01K = smd 1.4 x 1.05: A1 -1.8,0.725; A2 1.8,0.725; B3 -1.8,-0.725; B4 1.8,-0.725
PAD.03X.03 = smd 0.762 x 0.762: P$1 0,0
TQFP64 = smd 1.2 x 0.29: 1 -5.7,3.75; 2 -5.7,3.25; 3 -5.7,2.75; 4 -5.7,2.25; 5 -5.7,1.75; 6 -5.7,1.25; 7 -5.7,0.75; 8 -5.7,0.25; 9 -5.7,-0.25; 10 -5.7,-0.75; 11 -5.7,-1.25; 12 -5.7,-1.75; 13 -5.7,-2.25; 14 -5.7,-2.75; 15 -5.7,-3.25; 16 -5.7,-3.75; 33 5.7,-3.75; 34 5.7,-3.25; 35 5.7,-2.75; 36 5.7,-2.25; 37 5.7,-1.75; 38 5.7,-1.25; 39 5.7,-0.75; 40 5.7,-0.25; 41 5.7,0.25; 42 5.7,0.75; 43 5.7,1.25; 44 5.7,1.75; 45 5.7,2.25; 46 5.7,2.75; 47 5.7,3.25; 48 5.7,3.75 | smd 0.29 x 1.2: 17 -3.75,-5.7; 18 -3.25,-5.7; 19 -2.75,-5.7; 20 -2.25,-5.7; 21 -1.75,-5.7; 22 -1.25,-5.7; 23 -0.75,-5.7; 24 -0.25,-5.7; 25 0.25,-5.7; 26 0.75,-5.7; 27 1.25,-5.7; 28 1.75,-5.7; 29 2.25,-5.7; 30 2.75,-5.7; 31 3.25,-5.7; 32 3.75,-5.7; 49 3.75,5.7; 50 3.25,5.7; 51 2.75,5.7; 52 2.25,5.7; 53 1.75,5.7; 54 1.25,5.7; 55 0.75,5.7; 56 0.25,5.7; 57 -0.25,5.7; 58 -0.75,5.7; 59 -1.25,5.7; 60 -1.75,5.7; 61 -2.25,5.7; 62 -2.75,5.7; 63 -3.25,5.7; 64 -3.75,5.7
TI-DCU = smd 0.27 x 0.8: 1 -0.75,-1.55; 2 -0.25,-1.55; 3 0.25,-1.55; 4 0.75,-1.55; 5 0.75,1.55; 6 0.25,1.55; 7 -0.25,1.55; 8 -0.75,1.55
SOT-223 = smd 1.219 x 2.235: 1 -2.311,-3.099; 2 0,-3.099; 3 2.311,-3.099 | smd 3.6 x 2.2: 4 0,3.099
SOT23-5 = smd 0.55 x 1.2: 1 -0.95,-1.3; 2 0,-1.3; 3 0.95,-1.3; 4 0.95,1.3; 5 -0.95,1.3
MSOP-8 = smd 0.41 x 1.02: 1 -0.975,-2.4; 2 -0.325,-2.4; 3 0.325,-2.4; 4 0.975,-2.4; 5 0.975,2.4; 6 0.325,2.4; 7 -0.325,2.4; 8 -0.975,2.4
LIS331DLH-MAN = smd 0.85 x 0.285: 1 -1.425,1; 2 -1.425,0.5; 3 -1.425,0; 4 -1.425,-0.5; 5 -1.425,-1; 9 1.425,-1; 10 1.425,-0.5; 11 1.425,0; 12 1.425,0.5; 13 1.425,1 | smd 0.285 x 0.85: 6 -0.5,-1.425; 7 0,-1.425; 8 0.5,-1.425; 14 0.5,1.425; 15 0,1.425; 16 -0.5,1.425
BMP085 = smd 1.67 x 0.8: 1 -2.065,1.27; 2 -2.065,0; 3 -2.065,-1.27; 5 2.065,-1.27; 6 2.065,0; 7 2.065,1.27 | smd 0.8 x 1.67: 4 0,-2.065 | smd 0.8 x 2.5: 8 0,1.65
HMC5883L-MAN = smd 0.85 x 0.285: 1 -1.475,0.75; 2 -1.475,0.25; 3 -1.475,-0.25; 4 -1.475,-0.75; 9 1.475,-0.75; 10 1.475,-0.25; 11 1.475,0.25; 12 1.475,0.75 | smd 0.285 x 0.85: 5 -0.75,-1.475; 6 -0.25,-1.475; 7 0.25,-1.475; 8 0.75,-1.475; 13 0.75,1.475; 14 0.25,1.475; 15 -0.25,1.475; 16 -0.75,1.475
L3G4200DH-MAN = smd 0.9 x 0.4: 1 -1.9,0.975; 2 -1.9,0.325; 3 -1.9,-0.325; 4 -1.9,-0.975; 9 1.9,-0.975; 10 1.9,-0.325; 11 1.9,0.325; 12 1.9,0.975 | smd 0.4 x 0.9: 5 -0.975,-1.9; 6 -0.325,-1.9; 7 0.325,-1.9; 8 0.975,-1.9; 13 0.975,1.9; 14 0.325,1.9; 15 -0.325,1.9; 16 -0.975,1.9
MOUNT-HOLE2.1 = hole 2.1: 0,0
OSCILLATOR-5.0X3.2 = smd 1.8 x 1.2: 1 -2,-1.2; 2 2,-1.2; 3 2,1.2; 4 -2,1.2
53261-05 = smd 0.8 x 2: 1 2.5,-2.5; 2 1.25,-2.5; 3 0,-2.5; 4 -1.25,-2.5; 5 -2.5,-2.5 | smd 2.1 x 3: S1 5,0.625; S2 -5,0.625

### Placement (x,y rotation side)
C1  14.43,29.84 90 top
C2  15.14,20.52 90 top
C3  15.62,13.29 315 top
C4  19.92,13.03 45 top
C5  12.83,8.89 270 top
C6  37.97,13.61 180 top
C7  38.94,15.39 180 top
C8  33.96,16.51 270 top
C9  26.87,29.84 90 top
C10  16.53,20.52 270 top
C11  32.49,16.51 270 top
C12  28.35,29.84 90 top
C13  38.73,7.37 180 top
C14  41.27,11.43 270 top
C15  20.86,11.97 225 top
C16  35.56,11.43 270 top
C17  13.06,29.84 270 top
C18  29.84,10.57 270 top
C19  26.29,2.46 90 top
C20  24.82,2.46 90 top
C21  35.56,5.59 0 top
C22  24.61,11.61 0 top
C23  25.27,8.36 270 top
C24  26.64,8.36 90 top
C25  35.56,4.11 0 top
C26  35.56,2.54 0 top
C27  39.42,28.14 270 top
D1  37.47,26.92 270 top
F1  8.45,28.35 270 top
F2  5.75,10.7 0 top
J1  2.64,22.28 90 top
J2  45.97,17.51 270 bottom
J3  45.97,17.51 90 top
J4  2.22,4.83 270 top
J5  32.66,33.53 270 top
J6  23.44,34.16 180 top
JP1  15.75,26.62 90 top
JP2  13.72,20.52 90 top
L1  10.31,28.32 270 top
L2  6.99,28.37 90 top
L3  6.45,9.32 180 top
L4  7.98,5.31 180 top
L5  7.98,6.68 180 top
L6  21.29,29.84 270 top
L7  18.54,29.84 270 top
L8  35.76,27.3 90 top
L9  8.71,8.89 90 top
L10  10.08,8.89 90 top
L11  41.27,14.1 270 top
LED1  27.58,33.53 180 top
LED2  24.89,33.53 180 top
LED3  26.26,33.53 180 top
R1  19.91,29.84 90 top
R2  17.17,29.84 90 top
R3  19.05,26.67 90 top
R4  17.58,26.67 90 top
R5  32.13,13.89 0 top
R6  32.21,27.41 270 top
R7  43.99,34.24 0 top
R8  30.63,27.41 270 top
R9  47.24,34.24 180 top
R10  18.31,8.89 90 top
R11  11.46,8.89 90 top
R12  14.2,8.89 90 top
R13  25.5,29.84 90 top
R14  22.71,29.84 90 top
R15  24.08,29.84 90 top
R16  11.68,28.32 270 top
R18  33.07,20.27 90 top
R19  16.94,8.89 90 top
R20  15.57,8.89 90 top
R21  35.56,1.07 0 top
R22  34.29,27.3 270 top
S1  14.94,33.15 180 top
TP1  19.41,25.81 0 bottom
TP2  27.03,6.1 0 bottom
TP3  28.04,8.94 0 bottom
TP4  27.03,7.72 0 bottom
TP5  28.71,31.8 0 bottom
TP6  18.69,9.14 0 bottom
TP7  16.87,7.21 0 bottom
TP8  26.17,31.8 0 bottom
TP9  23.63,31.8 0 bottom
TP10  21.08,31.8 0 bottom
TP11  18.54,31.8 0 bottom
TP12  16,31.8 0 bottom
U1  24.77,20.32 45 top
U2  11.68,24.13 0 top
U3  8.59,24.13 0 top
U4  8.59,18.95 0 top
U5  8.64,13.67 0 top
U6  38.35,20.5 0 top
U7  38.23,10.92 90 top
U8  15.88,3.81 0 top
U9  32.72,9.96 90 top
U10  21.01,3.33 90 top
U11  22.35,8.94 0 top
U12  31.09,4.06 270 top
U$1  39.5,2.5 0 top
U$2  9.5,32.5 0 top
U$3  9.5,2.5 0 top
U$4  39.5,32.5 0 top
X1  17.14,15.54 135 top
X3  20.22,2.54 180 bottom

### Tracks (layer width: path | path; a pad name or v marks a point on that pad's centre or on a via)
!JTRST  (via drill 0.3)
  Top 0.203: U1.56 20.32,25.12 v20.32,26.82
  Route2 0.203: v20.32,26.82 19.71,27.43 19.71,30.28 18.36,31.62 J6.10
  Bottom 0.203: TP12.P$1 16,31.85 16.97,32.82 18.29,32.82 J6.10
ACCEL_CS  (via drill 0.3)
  Top 0.203: U1.4 19.65,18.39 20.22,18.39 v20.32,18.29 | v34.54,11.38 34.54,10.86 U9.8
  Bottom 0.203: v20.32,18.29 21.95,18.29 22.15,18.09 22.15,15.04 26.42,10.77 33.93,10.77 v34.54,11.38
ADC123_IN10  (via drill 0.3)
  Top 0.203: v21.54,17.68 21.54,17.45 U1.8 | R11.1 11.53,8.24 C5.1 R12.2 14.2,12.27 v14.43,12.5
  Bottom 0.203: v14.43,12.5 16.36,12.5 v21.54,17.68
ADC123_IN11  (via drill 0.3, 0.3 pad 0.51)
  Top 0.203: v23.77,17.88 22.68,17.88 U1.9 | J2.28 43.3,5.49 v44.91,5.49
  Route2 0.203: v33.53,13.01 33.83,13.31 36.68,13.31 39.22,10.77 v39.22,5.99
  Bottom 0.203: v23.77,17.88 28.65,13.01 v33.53,13.01 | 43.3,5.49 v44.91,5.49 | v39.22,5.99 41.15,5.99 41.66,5.49 43.3,5.49 | 43.3,5.49 J2.28
ADC123_IN12  (via drill 0.3, 0.3 pad 0.51)
  Top 0.203: v23.16,17.17 22.68,17.17 U1.10 | J2.29 48.58,3.45 v46.94,3.45
  Route2 0.203: v38.3,5.79 38.3,10.97 36.68,12.6 v34.34,12.6
  Bottom 0.203: v23.16,17.17 23.88,17.17 28.45,12.6 31.5,12.6 31.7,12.39 34.14,12.39 v34.34,12.6 | J2.29 48.58,3.45 v46.94,3.45 46.23,3.45 45.21,4.47 41.66,4.47 40.74,5.38 38.71,5.38 v38.3,5.79
ADC123_IN13  (via drill 0.3, 0.3 pad 0.51)
  Top 0.203: v23.67,16.46 22.67,16.46 U1.11 | J2.30 44.85,3.51 v44.91,3.45
  Route2 0.203: v37.39,10.97 v37.39,5.79
  Bottom 0.203: v23.67,16.46 23.88,16.46 28.14,12.19 31.29,12.19 31.5,11.99 36.37,11.99 v37.39,10.97 | J2.30 43.27,3.45 | v44.91,3.45 43.37,3.45 J2.30 | J2.30 42.01,3.51 40.54,4.98 38.2,4.98 v37.39,5.79
BOOT0  (via drill 0.3)
  Top 0.203: v18.9,24.89 18.9,23.71 U1.60 | R18.2 33.07,21.79 v33.02,21.84
  Bottom 0.203: TP1.P$1 18.9,25.3 v18.9,24.89 20.12,24.89 22.05,22.96 23.67,22.96 24.08,23.37 28.04,23.37 29.46,21.95 32.92,21.95 v33.02,21.84
CAN2_RX  (via drill 0.3)
  Top 0.203: U1.33 31.45,21.08 v32,20.52 | v45.11,21.23 45.62,21.74 45.62,26.82 44.93,27.51 44.88,27.51 | 44.88,27.51 v44.91,27.53 | 44.88,27.51 J2.6
  Route2 0.203: v39.52,20.52 39.73,20.73 44.6,20.73 v45.11,21.23
  Bottom 0.203: v32,20.52 v39.52,20.52 | J2.6 43.34,27.53 v44.91,27.53
CAN2_TX  (via drill 0.3)
  Top 0.203: J2.5 47.02,27.51 v46.94,27.43 46.13,26.62 46.13,19.71 v45.92,19.51 | U1.34 30.48,21.44 30.48,21.13 31.9,19.71 v32,19.71
  Route2 0.203: v39.52,19.71 39.93,19.71 40.44,20.22 45.21,20.22 v45.92,19.51
  Bottom 0.203: v32,19.71 v39.52,19.71 | v46.94,27.43 47.02,27.51 J2.5 48.55,27.43 v46.94,27.43
GND  (via drill 0.3, 0.5)  (30 unrouted)
  Top 0.203: U11.11 23.29,9.19 22.96,8.87 22.96,8.46 23.22,8.2 23.81,8.2
  Top 0.254: C14.2 41.13,10.92 | C17.1 C1.2 14.43,33.63 14.67,33.87 S1.B3 18.07,33.87 J6.9 J6.5 J6.3 | C25.2 C21.2 | R12.1 C5.2 12.83,7.37 v12.75,7.29 | U8.1 U8.2 U8.3 U8.4 v18.09,1.41 19.59,1.41 U10.1 | U9.13 U9.12 32.22,12.1 32.31,12.19 32.92,12.19 | 32.92,12.19 33.12,12.19 33.22,12.1 U9.10 | C11.2 32.49,14.19 R5.2 32.78,12.33 32.92,12.19 | U1.18 27.03,13.46 27.03,13.01 26.62,12.6 | U9.16 30.3,9.46 C18.2 29.46,9.54 v29.46,9.04 | C20.2 C19.2 v27.03,3.86 27.8,3.09 U12.8 29.19,2.31 29.36,2.13 30.08,2.13 U12.9 U12.10 U12.11 U12.12 32.85,2.16 33.02,2.34 | 40.64,7.87 C13.C 40.19,7.32 | C2.2 15.14,21.64 v15.54,22.05 16.15,22.66 17.83,22.66 U1.63 | v23.16,15.85 22.77,15.85 U1.12 | 30.28,31.7 30.18,31.7 30.16,31.69 J5.GND3 29.43,30.5 C12.2 C9.2 25.6,29.23 25.53,29.23 | v36.47,10.97 36.27,10.77 C16.2 | 43.36,29.46 J2.4 | v46.94,29.46 46.94,29.51 | U6.1 35.56,17.88 | U9.5 34.14,8.11 v34.14,7.52 | v3.45,13.51 3.47,13.53 | 25.53,29.23 25.4,29.23 | R13.1 25.53,29.23 | C3.2 16.18,12.83 16.87,13.51 17.48,13.51 X1.4 17.89,13.11 18.29,13.11 | v46.94,5.49 46.96,5.51 | X1.2 15.69,18.69 v15.54,18.69 16.53,19.68 C10.2 | v25.6,6.81 25.27,7.14 C23.2 25.16,7.82 24.59,7.82 24.22,8.19 U11.9 23.81,8.2 | C22.2 25.26,11.85 | J5.GND2 35.27,31.33 | U3.2 8.34,23.16 8.13,23.37 7.52,23.37 v7.01,22.86 | U2.2 11.43,22 11.18,21.74 10.57,21.74 v10.26,22.05 | U4.2 8.34,19 v8.13,19.2 | U5.4 9.39,11.21 v9.35,11.18 | R21.1 34.29,1.07 33.02,2.34 | 33.02,2.34 33.02,3.06 U12.13 | R18.1 33.21,19.62 v34.95,17.88
  Top 0.305: 19.23,12.57 C4.1 | 19.23,12.57 18.69,13.11 18.29,13.11 | 19.23,12.57 19.23,11.55 v19.3,11.48 | 20.37,11.48 C15.2 | v37.19,4.78 37.19,4.47 36.88,4.17 36.26,4.17 C25.2
  Top 0.381: C16.2 35.7,10.92
  Top 0.406: J5.GND4 30.16,33.08 J5.GND3 30.66,30.73 J5.5 | 35.64,31.7 J5.GND2 35.26,31.32 35.26,32.82 35.61,33.18 J5.GND1
  Top 0.508: 41.13,10.92 U7.2 | C11.2 C8.2 34.5,15.86 U6.1 | 26.01,12.6 26.62,12.6 | C14.2 40.64,10.14 40.64,7.87 | 40.19,7.32 v41.45,7.32 | 26.01,12.6 24.99,13.61 v24.99,13.82 | 35.56,17.88 v34.95,17.88 | v19.3,11.48 20.37,11.48 | 25.26,11.85 26.01,12.6
  Top 0.635: 30.18,31.7 v27.64,31.7 | 3.47,13.53 J1.15 | 35.64,31.7 v36.58,31.7 | C7.2 38.29,14.7 C6.C v38.1,13.61 | C27.C v39.42,28.25 | J4.2 3.68,6.33 v3.66,6.3 | J4.6 3.75,2.33 v3.66,2.23
  Top 1.016: v45.01,29.46 43.36,29.46 | 46.94,29.51 J2.3 | 46.96,5.51 J2.27
  Bottom 0.254: 48.59,29.46 J2.3 | J2.4 43.36,29.46 | v46.94,5.49 46.96,5.51 | X3.5 17.72,1.78 v18.09,1.41 | v25.6,6.81 25.6,6.71
  Bottom 1.016: v46.94,29.46 48.59,29.46 | 43.36,29.46 v45.01,29.46 | 46.96,5.51 J2.27
  other vias: 33.93,1.42
  pour Route15: -0.41,35.46 -0.41,-0.3 50.7,-0.3 50.7,35.46
GPIO1  (via drill 0.3)
  Top 0.203: U1.24 27.74,17 v27.74,18.59 | v8.33,13.51 8.39,13.46 U5.2
  Bottom 0.203: v27.74,18.59 24.89,18.59 23.57,19.91 20.42,19.91 14.12,13.61 8.43,13.61 v8.33,13.51
GPIO2  (via drill 0.3)
  Top 0.203: U1.25 28.35,17.09 v28.35,17.88 | v9.14,13.01 8.89,12.75 U5.3
  Bottom 0.203: v28.35,17.88 24.89,17.88 23.27,19.51 20.62,19.51 14.12,13.01 v9.14,13.01
GPIO_DIR  (via drill 0.3)
  Top 0.203: U1.2 19.41,19.56 v19.41,19.81 | v10.06,15.24 10.03,15.21 U5.5
  Bottom 0.203: v19.41,19.81 14.83,15.24 v10.06,15.24
GPIO_EXT1  (via drill 0.3)
  Top 0.203: v41.66,9.55 41.7,9.51 J2.24 | J1.13 8.15,16.03 8.39,15.79 U5.7 8.39,14.37 8.94,13.82 9.35,13.82 10.16,13.01 v10.16,12.39
  Bottom 0.203: v10.16,12.39 10.36,12.6 13.11,12.6 13.82,11.89 17.58,11.89 19.1,10.36 40.84,10.36 v41.66,9.55 41.7,9.51 J2.24
GPIO_EXT2  (via drill 0.3)
  Top 0.203: v46.94,7.52 46.95,7.51 J2.25 | J1.12 6.2,17.27 7.01,16.46 8.43,16.46 8.89,16.01 U5.6 8.89,14.48 9.14,14.22 9.96,14.22 10.77,13.41 v10.77,11.79
  Bottom 0.203: J2.25 48.62,7.52 v46.94,7.52 45.92,8.53 41.66,8.53 40.23,9.96 18.9,9.96 17.37,11.48 13.61,11.48 12.9,12.19 11.18,12.19 v10.77,11.79
GYRO_CS  (via drill 0.3)
  Top 0.203: U1.3 19.45,18.9 v20.93,18.9 | v26.72,11.38 27.64,10.46 27.64,5.69 28.29,5.04 U12.5
  Bottom 0.203: v20.93,18.9 21.95,18.9 22.55,18.29 22.55,15.24 26.42,11.38 v26.72,11.38
I2C1_SCL
  Top 0.203: U1.61 18.29,23.61 18.29,25.26 R3.1
I2C1_SCL_EXT
  Top 0.203: R3.2 19.05,27.38 19.91,28.25 R1.1 19.98,29.2 L6.1
I2C1_SDA
  Top 0.203: U1.62 17.58,23.62 R4.1
I2C2_SCL  (via drill 0.3)
  Top 0.203: R20.1 16.2,7.61 U8.6 16.2,4.93 v16.26,4.88 17.07,4.06 20.73,4.06 20.83,4.17 | v30.89,15.95 31.09,16.15 31.09,17.18 U1.29 | J2.17 47,15.51 v46.94,15.44 | 20.83,4.17 21.01,4.34 U10.6 | v21.44,3.45 21.44,3.56 20.83,4.17 | U11.1 20.36,9.69 v19.81,9.14
  Route2 0.203: v16.26,4.88 16.26,7.32 18.09,9.14 v19.81,9.14 20.22,9.14 21.95,10.87 23.67,10.87 28.75,15.95 v30.89,15.95
  Bottom 0.203: v30.89,15.95 30.68,15.75 30.68,15.04 30.89,14.83 35.76,14.83 35.97,14.63 46.13,14.63 v46.94,15.44 47,15.51 J2.17 | 21.45,3.47 v21.44,3.45 21.47,3.48 X3.2 | v19.81,9.14 TP6.P$1
I2C2_SDA  (via drill 0.3, 0.3 pad 0.51)
  Top 0.203: U1.30 31.5,17.48 v31.5,15.44 | v44.91,15.44 44.84,15.51 J2.18 | R19.1 16.94,8.1 16.87,8.03 16.87,6.23 U8.5 17.37,6.73 v17.68,6.73 17.91,6.5 19.71,6.5 19.74,6.48 U10.7 | U11.16 19.86,10.42 19.2,9.75 19.2,8.74 v19.71,8.23
  Route2 0.203: v31.5,15.44 31.29,15.24 28.75,15.24 23.98,10.46 22.15,10.46 19.91,8.23 v19.71,8.23 18.29,8.23 17.68,7.62 v17.68,6.73
  Bottom 0.203: v44.91,15.44 43.38,15.44 J2.18 31.5,15.51 v31.5,15.44 | X3.3 20.32,5.14 20.32,5.89 19.71,6.5 17.88,6.5 17.68,6.71 v17.68,6.73 17.35,6.73 TP7.P$1
I2C2_SDA_EXT
  Top 0.203: L7.1 17.24,29.2 R2.1 17.17,28.55 17.58,28.14 R4.2
I2C3_SCL  (via drill 0.3)
  Top 0.203: U1.41 29.19,25.09 34.34,25.09 v34.85,25.6 | v46.94,23.57 47,23.51 J2.9 | R9.1 47.89,33.18 v47.95,33.12
  Route2 0.203: v47.95,33.12 47.95,24.59 v46.94,23.57
  Bottom 0.203: v34.85,25.6 35.26,26.01 40.23,26.01 41.66,24.59 45.92,24.59 v46.94,23.57 47,23.51 J2.9
I2C3_SDA  (via drill 0.3, 0.3 pad 0.51)
  Top 0.203: v44.91,23.57 44.84,23.51 J2.10 | U1.40 29.49,24.69 34.95,24.69 v35.66,25.4 | R7.1 43.28,34.24 v43.28,33.12
  Route2 0.203: v43.28,33.12 43.28,25.2 v44.91,23.57
  Bottom 0.203: v35.66,25.4 36.37,25.4 37.08,24.69 40.54,24.69 41.72,23.51 J2.10 43.38,23.57 v44.91,23.57
JTCK-SWCLK  (via drill 0.3)
  Top 0.203: v22.35,28.04 U1.49
  Route2 0.203: v22.35,28.04 22.35,32.72 J6.4
  Bottom 0.203: TP9.P$1 22.66,31.8 22.35,32.11 22.35,32.72 J6.4
JTDI  (via drill 0.3)
  Top 0.203: v21.54,26.82 21.95,27.23 22.45,27.23 U1.50
  Route2 0.203: v21.54,26.82 20.12,28.25 20.12,31.09 19.63,31.57 J6.8
  Bottom 0.203: TP11.P$1 19.43,31.8 19.63,32 J6.8
JTDO  (via drill 0.3)
  Top 0.203: U1.55 20.73,25.42 20.73,26.01 v20.93,26.21
  Route2 0.203: v20.93,26.21 21.34,25.81 21.74,25.81 22.35,26.42 22.35,27.03 21.74,27.64 21.74,30.84 20.9,31.67 J6.6
  Bottom 0.203: TP10.P$1 21.08,32.72 J6.6
JTMS-SWDIO  (via drill 0.3)
  Top 0.203: U1.46 28.04,27.49 v28.04,28.04
  Route2 0.203: v28.04,28.04 23.44,32.64 J6.2
  Bottom 0.203: TP8.P$1 25.3,31.8 24.18,32.92 23.47,32.92 J6.2
LED_AMBER  (via drill 0.3)
  Top 0.203: U1.35 31.3,22.96 31.8,22.96 v32.21,22.55 | v23.06,28.35 22.71,28.7 R14.1
  Route2 0.203: v33.22,27.84 32.21,26.82 v32.21,22.55
  Bottom 0.203: v23.06,28.35 23.77,29.06 32,29.06 v33.22,27.84
LED_BLUE  (via drill 0.3)
  Top 0.203: U1.36 31,23.37 32.61,23.37 v32.82,23.16 | v24.08,28.35 R15.1
  Route2 0.203: v33.22,26.72 32.82,26.31 v32.82,23.16
  Bottom 0.203: v24.08,28.35 25.7,26.72 v33.22,26.72
MAG_DRDY  (via drill 0.3)
  Top 0.203: v29.06,18.39 29.06,17.8 U1.27 | U11.15 22.1,11.03 v22.55,11.48
  Route2 0.203: v29.06,18.39 29.06,16.87 23.67,11.48 v22.55,11.48 | v14.53,4.57 14.94,4.98 14.94,7.21 18.19,10.46 18.19,11.68 v18.49,11.99
  Bottom 0.203: X3.4 18.97,0.98 18.69,0.71 17.27,0.71 16.87,1.12 16.87,5.28 16.56,5.59 15.54,5.59 v14.53,4.57 | v18.49,11.99 18.8,12.29 21.74,12.29 v22.55,11.48
N$1
  Top 0.203: X1.1 19.41,15.04 18.9,15.54 18.9,16.22 U1.6
  Top 0.305: X1.1 20.38,14.01 C4.2
N$2
  Top 0.203: C3.1 15.65,14.23 15.65,15.35 X1.3 15.45,15.54 17.52,15.54 U1.5
N$3
  Top 0.508: L2.2 6.99,29.18 6.4,29.77 5.15,29.77 J1.2
N$4
  Top 0.203: U1.31 32.49,17.2 C11.1
N$5
  Top 0.635: L3.1 7.1,10 F2.2
N$6
  Top 0.203: U1.47 27.18,27.33 27.18,28.03 C12.1
N$8
  Top 0.203: L4.2 7.24,5.31 6.3,4.37 5.23,4.37 J4.4
N$9
  Top 0.203: U7.4 35.77,11.87 C16.1
N$10
  Top 0.254: C24.1 26.64,6.83 25.91,6.1 24.47,6.1 U11.8
N$11  (via drill 0.3)
  Top 0.254: v13.51,26.62 13.82,26.92 | v10.67,26.72 10.97,26.72 11.43,26.26 U2.7 | 13.82,26.92 15.4,26.92 JP1.2 | C1.1 14.43,28.96 13.82,28.35 13.82,26.92 | U3.7 8.34,25.1 8.13,24.89 7.52,24.89 v7.01,25.4
  Bottom 0.254: v13.51,26.62 13.11,26.21 11.28,26.21 10.77,26.72 v10.67,26.72 9.55,26.72 8.23,25.4 v7.01,25.4
N$12  (via drill 0.3)
  Top 0.203: U2.8 10.93,24.85 v10.87,24.79 | v3.56,24.79 5.13,24.79 J1.6
  Bottom 0.203: v3.56,24.79 v10.87,24.79
N$13  (via drill 0.3)
  Top 0.203: 5.19,23.57 J1.7 5.08,23.47 v3.56,23.47 | U2.1 10.93,23.41 v10.87,23.47
  Bottom 0.203: v3.56,23.47 v10.87,23.47
N$14  (via drill 0.3)
  Top 0.508: v6.67,31.03 J1.1 | v7.72,26.72 9.36,26.72 L1.2
  Route2 0.635: v6.67,31.03 6.67,27.77 v7.72,26.72
N$15
  Top 0.203: U3.8 7.49,26.03 J1.5
N$16
  Top 0.203: U3.1 7.53,22.28 J1.8
N$17
  Top 0.254: U11.12 24.42,9.69 24.69,9.96 26.31,9.96 26.62,9.65 26.62,9.03 C24.2
N$18  (via drill 0.3 pad 0.3)
  Top 0.508: 5.1,11.91 v5.18,11.99 | v10.77,20.32 11.58,21.13 13.68,21.13 JP2.2
  Top 0.635: F2.1 5.1,11.91
  Route2 0.508: v5.18,11.99 5.18,14.73 v10.77,20.32
N$19  (via drill 0.3)
  Top 0.203: v21.13,28.25 21.13,29.04 L6.2 | v3.56,28.45 5.06,28.45 J1.3
  Bottom 0.203: v21.13,28.25 20.52,28.85 3.96,28.85 v3.56,28.45
N$22  (via drill 0.3)
  Top 0.203: C17.2 13.06,29.11 | U1.7 20.93,17.55 20.93,17.98 22.76,19.81 22.76,22.55 24.79,24.59 v24.79,26.62 | v13.11,27.43 13.06,27.48 C17.2 | S1.A1 16.72,32.41 v15.34,32.41 | 11.89,29.17 v11.89,31.7 | C17.2 11.91,29.2 11.89,29.17 | 11.89,29.17 R16.1
  Bottom 0.203: v24.79,26.62 23.98,27.43 19.81,27.43 19.41,27.03 14.12,27.03 13.72,27.43 v13.11,27.43 | v11.89,31.7 12.6,32.41 v15.34,32.41
N$23
  Top 0.635: L8.1 36.14,26.27 D1.ANODE
N$24
  Top 0.635: L3.2 4.85,9.32 2.54,7.01 2.54,4.37 3.56,3.35 5.16,3.35 J4.5
N$25
  Top 0.203: L5.2 7.29,6.68 5.99,5.38 5.25,5.38 J4.3
N$26  (via drill 0.3)
  Top 0.203: L7.2 18.54,28.3 v18.59,28.25 | v3.56,27.33 3.61,27.28 J1.4
  Bottom 0.203: v18.59,28.25 18.49,28.35 4.47,28.35 3.56,27.43 v3.56,27.33
N$27
  Top 0.508: F1.2 7.01,27.7 L2.1
N$28
  Top 0.203: R15.2 26.26,32.68 LED3.C
N$29
  Top 0.203: R13.2 25.5,30.6 27.58,32.68 LED1.C
N$30
  Top 0.203: R14.2 24.89,32.68 LED2.C
N$31  (via drill 0.3)
  Top 0.203: v17.27,10.57 18.11,9.73 18.12,9.73 R10.2 | 8.74,8.21 L9.1 7.83,8.24 v7.82,8.23
  Bottom 0.203: v17.27,10.57 14.94,8.23 v7.82,8.23
N$32  (via drill 0.3)
  Top 0.203: J1.11 3.59,18.53 v3.56,18.49 | v11.89,10.46 v11.89,18.19 | v8.74,10.46 8.71,10.44 L9.2
  Bottom 0.203: v11.89,18.19 11.58,18.49 v3.56,18.49 | v8.74,10.46 v11.89,10.46
N$33
  Top 0.203: R21.2 C26.2
N$34
  Top 0.254: U12.14 34.53,3.74 C25.1 C26.1
N$35
  Top 0.203: L10.1 10.15,8.24 R11.2
N$36
  Top 0.254: U11.10 24.44,8.69 24.69,8.94 25.21,8.94 C23.1
N$37  (via drill 0.3)
  Top 0.203: J1.14 5.2,14.83 v6.6,14.83 | v11.07,14.22 11.48,13.82 11.48,11.58 10.08,10.19 L10.2
  Bottom 0.203: v6.6,14.83 7.21,14.22 v11.07,14.22
N$100
  Top 0.254: 41.07,11.87 C14.1
  Top 0.508: C14.1 L11.2 | 41.07,11.87 U7.3 38.54,11.87 38.3,11.63 38.3,10.34 38.67,9.97 U7.1
OTG_DM
  Top 0.203: R6.1 32.21,28.35 33.31,29.45 J5.2
OTG_DP
  Top 0.203: R8.1 30.63,28.5 30.89,28.75 31.7,28.75 32.66,29.72 J5.3
OTG_FS_DM
  Top 0.203: R6.2 31.46,26.01 30.07,26.01 29.87,26.21 28.18,26.21 U1.44
OTG_FS_DP
  Top 0.203: R8.2 28.02,26.76 U1.45
PB2-BOOT1
  Top 0.203: U1.28 30.68,16.88 30.68,16.66 30.28,16.26 30.28,14.43 30.81,13.89 R5.1
PC8  (via drill 0.3)
  Top 0.203: U1.39 29.31,23.82 27.13,21.64 27.13,16.66 v27.23,16.56 | v44.91,7.52 J2.26
  Route2 0.203: v35.26,14.12 36.58,14.12 40.74,9.96 40.74,9.14 41.35,8.53 43.89,8.53 v44.91,7.52
  Bottom 0.203: J2.26 44.9,7.51 v44.91,7.52 | v27.23,16.56 29.16,14.63 30.38,14.63 30.58,14.43 34.95,14.43 v35.26,14.12
PPM_INPUT  (via drill 0.3)
  Top 0.203: U1.26 29.87,16.27 v29.87,13.61 | v46.94,9.55 46.98,9.51 J2.23 | R10.1 18.31,7.49 v18.49,7.32
  Route2 0.203: v18.49,7.32 21.54,7.32 27.84,13.61 v29.87,13.61
  Bottom 0.203: v29.87,13.61 34.24,13.61 35.36,12.5 36.78,12.5 38.51,10.77 41.25,10.77 41.66,10.36 46.13,10.36 v46.94,9.55 48.59,9.55 J2.23
PRES_DRDY  (via drill 0.3)
  Top 0.203: U1.43 27.27,24.59 25.4,24.59 23.16,22.35 v23.16,18.59 | v15.54,4.27 15.54,2.95 15.95,2.54 20.32,2.54 21.01,1.85 U10.2
  Route2 0.203: v23.16,18.59 22.35,17.78 22.35,12.19 20.32,10.16 18.49,10.16 15.54,7.21 v15.54,4.27
SPI1_MISO  (via drill 0.3)
  Top 0.203: U1.22 28.45,14.87 28.45,7.92 v28.85,7.52 29.67,7.52 30.11,7.07 U12.4 | U9.7 35.15,9.96 v36.17,8.94
  Bottom 0.203: v36.17,8.94 35.56,8.33 30.68,8.33 29.87,7.52 v28.85,7.52 27.23,7.52 TP4.P$1
SPI1_MOSI  (via drill 0.3)
  Top 0.203: U1.23 28.85,15.17 28.85,8.74 v29.46,8.13 29.67,8.13 30.77,7.03 U12.3 | U9.6 34.64,9.46 v35.15,8.94
  Bottom 0.203: v35.15,8.94 30.68,8.94 29.87,8.13 v29.46,8.13 28.85,8.13 TP3.P$1
SPI1_SCK  (via drill 0.3)
  Top 0.203: U1.21 28.04,14.57 28.04,7.11 v28.25,6.91 | U12.2 31.41,7.4 v31.09,7.72 | v33.33,7.52 33.22,7.63 U9.4
  Bottom 0.203: v33.33,7.52 32.92,7.92 31.29,7.92 v31.09,7.72 30.28,6.91 v28.25,6.91 27.84,6.91 TP2.P$1
SPI3_MISO  (via drill 0.3)
  Top 0.203: J2.13 v46.94,19.51 | v23.98,24.79 23.48,24.79 U1.52
  Bottom 0.203: v23.98,24.79 33.43,24.79 34.24,23.98 35.97,23.98 36.47,23.47 39.73,23.47 41.05,22.15 41.05,21.13 41.66,20.52 45.92,20.52 v46.94,19.51 J2.13
SPI3_MOSI  (via drill 0.3)
  Top 0.203: 20.56,24.15 U1.57 21.16,23.57 21.54,23.57 v21.95,23.98 | v41.66,21.54 41.69,21.51 J2.12
  Bottom 0.203: v21.95,23.98 23.37,25.4 33.43,25.4 34.44,24.38 36.17,24.38 36.68,23.88 39.93,23.88 41.66,22.15 v41.66,21.54 41.69,21.51 J2.12
SPI3_NSS  (via drill 0.3)
  Top 0.203: U1.20 26.62,15.28 26.62,22.66 v26.52,22.76 | J2.14 v44.91,19.51
  Route2 0.203: v39.52,18.8 44.2,18.8 v44.91,19.51
  Bottom 0.203: v26.52,22.76 28.04,22.76 32,18.8 v39.52,18.8 | J2.14 v44.91,19.51
SPI3_SCK  (via drill 0.3)
  Top 0.203: U1.51 23.17,25.81 23.98,25.81 v24.18,26.01 | v46.94,21.54 46.97,21.51 J2.11
  Bottom 0.203: v24.18,26.01 33.43,26.01 34.65,24.79 36.37,24.79 36.88,24.28 40.13,24.28 42.06,22.35 46.13,22.35 v46.94,21.54 46.97,21.51 J2.11
UART5_RX  (via drill 0.3, 0.3 pad 0.51)
  Top 0.203: v44.91,17.48 43.35,17.48 J2.16 | v22.76,23.57 22.76,24.09 U1.54
  Bottom 0.203: v22.76,23.57 23.67,23.57 23.88,23.77 33.22,23.77 33.83,23.16 35.56,23.16 36.07,22.66 39.32,22.66 40.23,21.74 40.23,18.09 40.84,17.48 43.29,17.48 J2.16 44.87,17.51 v44.91,17.48
UART5_TX  (via drill 0.3)
  Top 0.203: J2.15 46.97,17.51 v46.94,17.48 | v23.37,24.18 23.37,24.19 U1.53
  Bottom 0.203: v23.37,24.18 33.43,24.18 34.04,23.57 35.76,23.57 36.27,23.06 39.52,23.06 40.64,21.95 40.64,18.9 41.05,18.49 45.92,18.49 v46.94,17.48 46.97,17.51 J2.15
USART1_RX  (via drill 0.3)
  Top 0.203: U1.59 20.42,22.9 20.42,22.45 18.59,20.62 v18.59,19.91 | v10.06,17.37 10.03,17.4 U4.4
  Bottom 0.203: v18.59,19.91 16.05,17.37 v10.06,17.37
USART1_RX_EXT  (via drill 0.3)
  Top 0.203: v2.85,19.91 2.98,19.78 J1.10 | J2.8 43.41,25.6 v44.91,25.6
  Top 0.254: J1.10 6.54,19.78 7.11,19.2 7.11,18.12 U4.1
  Bottom 0.203: v2.85,19.91 2.85,28.85 3.66,29.67 32.51,29.67 35.76,26.42 40.74,26.42 41.65,25.51 J2.8 44.81,25.51 v44.91,25.6
USART1_TX  (via drill 0.3)
  Top 0.203: U1.58 20.83,23.2 20.83,21.84 v20.32,21.34 | v9.55,21.34 9.55,21.03 9.35,20.83 U4.5
  Bottom 0.203: v9.55,21.34 v20.32,21.34
USART1_TX_EXT  (via drill 0.3)
  Top 0.203: v2.03,21.03 v2.04,21.03 J1.9 7.31,21.03 U4.8 | J2.7 47.03,25.51 v46.94,25.6
  Bottom 0.203: v2.03,21.03 2.03,28.65 3.45,30.07 32.72,30.07 35.97,26.82 41.35,26.82 41.66,26.52 45.99,26.52 46.91,25.6 v46.94,25.6 47.03,25.51 J2.7
USART2_CTS  (via drill 0.3, 0.3 pad 0.51)
  Top 0.203: U1.14 24.38,16.05 v24.38,22.15 | J2.19 47.04,13.51 v46.94,13.41 | U2.5 12.43,24.85 v12.6,24.69
  Route2 0.203: v39.52,17.88 39.62,17.88 43.38,14.12 46.23,14.12 v46.94,13.41
  Bottom 0.203: v39.52,17.88 39.42,17.88 38.81,17.27 32.92,17.27 28.04,22.15 v24.38,22.15 21.64,22.15 19.91,23.88 13.41,23.88 v12.6,24.69 | v46.94,13.41 48.53,13.41 J2.19
USART2_RTS  (via drill 0.3, 0.3 pad 0.51)
  Top 0.203: v24.99,21.54 24.89,21.44 24.89,15.85 U1.15 | J2.20 44.81,13.51 v44.91,13.41 | U2.4 12.43,23.41 v12.6,23.57
  Route2 0.203: v39.52,17.07 43.18,13.41 v44.91,13.41
  Bottom 0.203: v39.52,17.07 39.32,16.87 32.72,16.87 28.04,21.54 v24.99,21.54 23.98,21.54 23.77,21.74 21.44,21.74 19.71,23.47 12.7,23.47 v12.6,23.57 | v44.91,13.41 43.42,13.41 J2.20
USART2_RX  (via drill 0.3, 0.3 pad 0.51)
  Top 0.203: v26.01,20.73 26.21,20.52 26.21,15.85 25.6,15.24 25.6,14.18 U1.17 | J2.22 44.78,11.51 v44.91,11.38 45.82,12.29 v45.82,16.46 | U3.4 9.34,24.07 v9.45,24.18
  Bottom 0.203: J2.22 43.45,11.38 v44.91,11.38 | v9.45,24.18 11.07,24.18 12.29,22.96 19.61,22.96 21.44,21.13 24.18,21.13 24.59,20.73 v26.01,20.73 28.25,20.73 32.51,16.46 v45.82,16.46
USART2_TX  (via drill 0.3)
  Top 0.203: v25.6,22.76 25.6,21.23 25.4,21.03 25.4,17.17 | U1.16 25.4,15.65 25.4,17.17 | J2.21 47.01,11.51 v46.94,11.58 | 25.4,17.17 v25.6,17.17 | v10.06,25.6 9.98,25.68 U3.5
  Bottom 0.203: J2.21 48.55,11.58 v46.94,11.58 46.13,12.39 37.49,12.39 36.98,12.9 35.56,12.9 34.44,14.02 30.38,14.02 30.18,14.22 28.55,14.22 v25.6,17.17 | v10.06,25.6 13.82,25.6 15.14,24.28 20.12,24.28 21.84,22.55 23.88,22.55 24.08,22.76 v25.6,22.76
USART6_RX  (via drill 0.3)
  Top 0.203: v27.94,20.12 27.94,21.73 U1.38 | v12.8,19 13.51,18.29 v13.51,10.77 | v9.55,5.49 9.45,5.38 8.7,5.38 L4.1
  Route2 0.203: v13.51,10.77 13.51,9.45 v9.55,5.49
  Bottom 0.203: v27.94,20.12 24.59,20.12 23.98,20.73 20.02,20.73 19.81,20.93 14.73,20.93 v12.8,19
USART6_TX  (via drill 0.3)
  Top 0.203: U1.37 28.65,21.73 v28.65,19.2 | v12.7,11.28 v12.7,18.09 | v9.55,6.81 9.45,6.71 8.65,6.71 L5.1
  Route2 0.203: v12.7,11.28 12.7,9.96 v9.55,6.81
  Bottom 0.203: v28.65,19.2 24.89,19.2 23.77,20.32 19.71,20.32 19.51,20.52 15.44,20.52 13.01,18.09 v12.7,18.09
VBUS
  Top 0.254: 34.29,29.62 34.24,29.67
  Top 0.406: J5.1 33.96,29.94 34.24,29.67
  Top 0.635: L8.2 R22.1 34.29,29.62
VBUS_DETECT
  Top 0.203: 34.24,26.6 R22.2 33.65,26.01 33.63,26.01 33.12,25.5 28.89,25.5 U1.42
VDD_3V3  (via drill 0.3, 0.3 pad 0.3)  (28 unrouted)
  Top 0.254: R19.2 R20.2 15.57,10.44 v15.54,10.46 | 17.14,20.96 16.53,20.96 C10.1 | 17.14,20.96 17.4,20.96 18.09,21.64 U1.64 | LED1.A LED3.A LED2.A 23.56,34.28 J6.1 | U9.1 31.71,7.81 32.06,7.46 32.06,7.32 | U12.1 32.06,7.32 | 32.06,7.32 v32.51,7.32 | U1.19 27.53,13.66 27.53,12.6 27.33,12.39 v27.33,11.99 | 17.14,20.96 17.88,20.21 17.88,19.14 U1.1 | v14.12,5.79 14.43,6.1 14.79,6.1 U8.8 | 24.58,1.81 C20.1 23.79,1.81 v23.57,2.03 23.07,2.53 U10.4 22.63,3.33 | U1.48 26.14,27.97 v26.42,28.25 26.67,28.5 26.67,28.91 26.87,29.11 C9.1 | U1.32 32.47,18.94 v33.22,18.19 33.96,17.45 C8.1 | v16.46,22.05 16.46,21.24 C10.1 | C2.1 15.23,19.87 C10.1 | U6.4 38.3,23.65 | U3.6 8.84,24.38 v8.64,24.18 8.64,24.08 8.84,23.88 U3.3 U4.6 | U2.3 U2.6 | U4.3 U4.6 | U4.6 U4.7 | U5.1 7.89,11.21 v7.92,11.18 | v15.75,25.09 JP1.1 | 38.3,17.07 38.3,17.35 U6.2 | R9.2 R7.2 44.64,33.18 v44.7,33.12
  Top 0.305: U2.6 11.93,26.67 v11.79,26.82 11.79,27.64 11.68,27.74 R16.2
  Top 0.508: F1.1 8.45,29.75 v7.52,30.68 | JP2.1 11.95,19.87 v11.89,19.81
  Top 0.635: U6.2 37.9,17.86 v37.9,21.44 | C6.A 36.57,15.34 38.3,17.07
  Bottom 0.203: TP5.P$1 28.71,31.84 27.94,32.61 25.7,32.61 24.18,34.14 23.47,34.14 J6.1
  other vias: 38.3,22.05 39.01,22.05 38.61,21.44 37.59,22.05 37.19,21.44 36.88,22.05 36.47,21.44 38.2,25.3 38.91,25.3 39.62,25.3 37.49,25.3
  pour Route2: -0.41,35.46 -0.41,-0.3 50.7,-0.3 50.7,35.46
  pour Top (no thermals): 37.08,25.6 35.66,24.28 33.93,24.28 33.93,19.81 34.75,19 38.81,19 38.91,19.1 38.91,21.03 40.13,22.05 40.03,25.2 39.62,25.6
VDD_3V3_ANALOG  (via drill 0.3)
  Top 0.203: U11.4 21.4,8.19 v22.25,9.04 23.1,9.89 U11.13
  Top 0.254: U1.13 22.32,14.7 21.59,13.97 21.59,12.7 C15.1 21.46,12.29 | U12.15 U12.16 34.36,5.04 C21.1 34.95,5.63 v34.95,6.71 | U9.15 U9.14 30.53,11.22 | 30.53,11.22 C18.1 | v30.89,11.58 v30.89,11.57 30.53,11.22 | U10.3 22.73,0.81 25.81,0.81 26.19,1.19 26.19,1.71 C19.1 27.21,1.81 v27.23,1.83 | U11.13 23.1,10.75 C22.1 | U11.2 22.1,9.19 v22.25,9.04
  Top 0.381: C13.A 35.61,7.37 v34.95,6.71
  Top 0.508: U7.5 37.34,9.56 C13.A | 21.46,12.29 23.28,12.29 C22.1
  Route2 0.254: 30.79,6.2 30.89,6.1
  Route2 0.381: 30.89,6.1 32.82,6.1 33.43,6.71 v34.95,6.71 | v30.89,11.58 30.28,10.97 30.28,6.71 30.79,6.2 30.79,5.38 30.48,5.08 | v27.23,1.83 30.48,5.08 | 30.48,5.08 v23.98,5.08
  Bottom 0.254: v23.98,5.08 23.94,5.04 X3.1
  Bottom 0.406: v22.25,9.04 23.98,7.32 v23.98,5.08
VDD_5V  (via drill 0.3, 0.3 pad 0.3, 0.5 pad 0.51)
  Top 0.254: 40.66,15.95 40.66,15.87 | R2.2 17.27,30.5 v17.27,31.39 | 43.33,31.5 arc-90 J2.2 43.31,31.5 | U5.8 7.89,14.39 v7.01,13.51 | C27.A 39.42,26.67 | v37.49,29.77 37.47,29.74 | v46.94,31.5 arc-90 46.95,31.51 arc-90 v46.94,31.5
  Top 0.381: 40.64,26.67 40.66,26.64
  Top 0.406: R1.2 19.91,31.19 19.71,31.39 v17.27,31.39
  Top 0.508: v11.18,30.79 10.36,29.97 10.36,29.02 L1.1 | v14.48,27.69 15.24,28.45 15.63,28.45 JP1.3 | JP2.3 14.51,22.47 v14.73,22.25
  Top 0.635: L11.1 41.27,15.26 40.66,15.87 | 39.42,26.67 40.64,26.67 | C27.A 37.99,28.17 D1.CATHODE 37.47,29.74 | 43.31,31.5 41.86,31.5 41.15,30.79 41.15,28.25 40.66,27.76 40.66,26.64 40.84,26.47 40.84,19.2 40.66,19.02 U6.3 40.66,15.95 40.11,15.39 C7.1
  Top 1.016: 46.95,31.51 J2.1 | 43.33,31.5 v45.01,31.5 v46.94,31.5
  Route2 0.254: v14.73,22.25 14.73,18.49 12.5,16.26 9.75,16.26 v7.01,13.51
  Route2 0.508: 14.53,27.64 v14.48,27.69
  Route2 0.635: v11.18,30.79 11.38,30.79 v14.48,27.69 | 14.53,27.64 14.53,22.45 v14.73,22.25
  Bottom 0.254: 48.62,31.5 arc90 J2.1 | v45.01,31.5 arc90 44.9,31.51
  Bottom 0.635: v11.18,30.79 11.28,30.89 16.76,30.89 v17.27,31.39 17.78,30.89 36.78,30.89 37.49,30.18 v37.49,29.77
  Bottom 1.016: v46.94,31.5 48.62,31.5 | 44.9,31.51 J2.2

### Text on the board
tPlace: (c) 2011 mjs
bPlace: PX2FMU v1.3 | 5V | JTAG | 3.3V | SCL | SDA | UA2_TX | BOOT0 | UA2_CTS | UA2_RTS | UA2_RX | UA1_TX | UA1_RX | PPM | GPIO1 | GPIO2 | ADC | GND | SENSOR I2C | GPS
tDocu: 5.0V | 5.0V | 3.3V | 3.3V
bDocu: RESET | USB | VDD_5V | JTAG | 1 | VDD_3V3 | I2C1_SCL | EXTERNAL | I2C1_SDA | USART2_TX | BOOT0 | POWER | ACTIVITY | ERROR | USART2_CTS | USART2_RTS | USART2_TX | USART1_TX | USART1_RX | EXPANSION | PPM INPUT | GPIO2 | GPIO1 | BATTERY | GND | PX2 FMU | 15 | FLIGHT | MANAGEMENT | SCL | MOSI | UNIT | GPS | SDA | MISO | SCK | v0.6